# Altium project TMDX654GPEVM.PrjPcb (part 17 of 24)

## Sheet 36-ETHERNET PHY CLOCK GENERATOR.SchDoc
size 513 x 386 mm
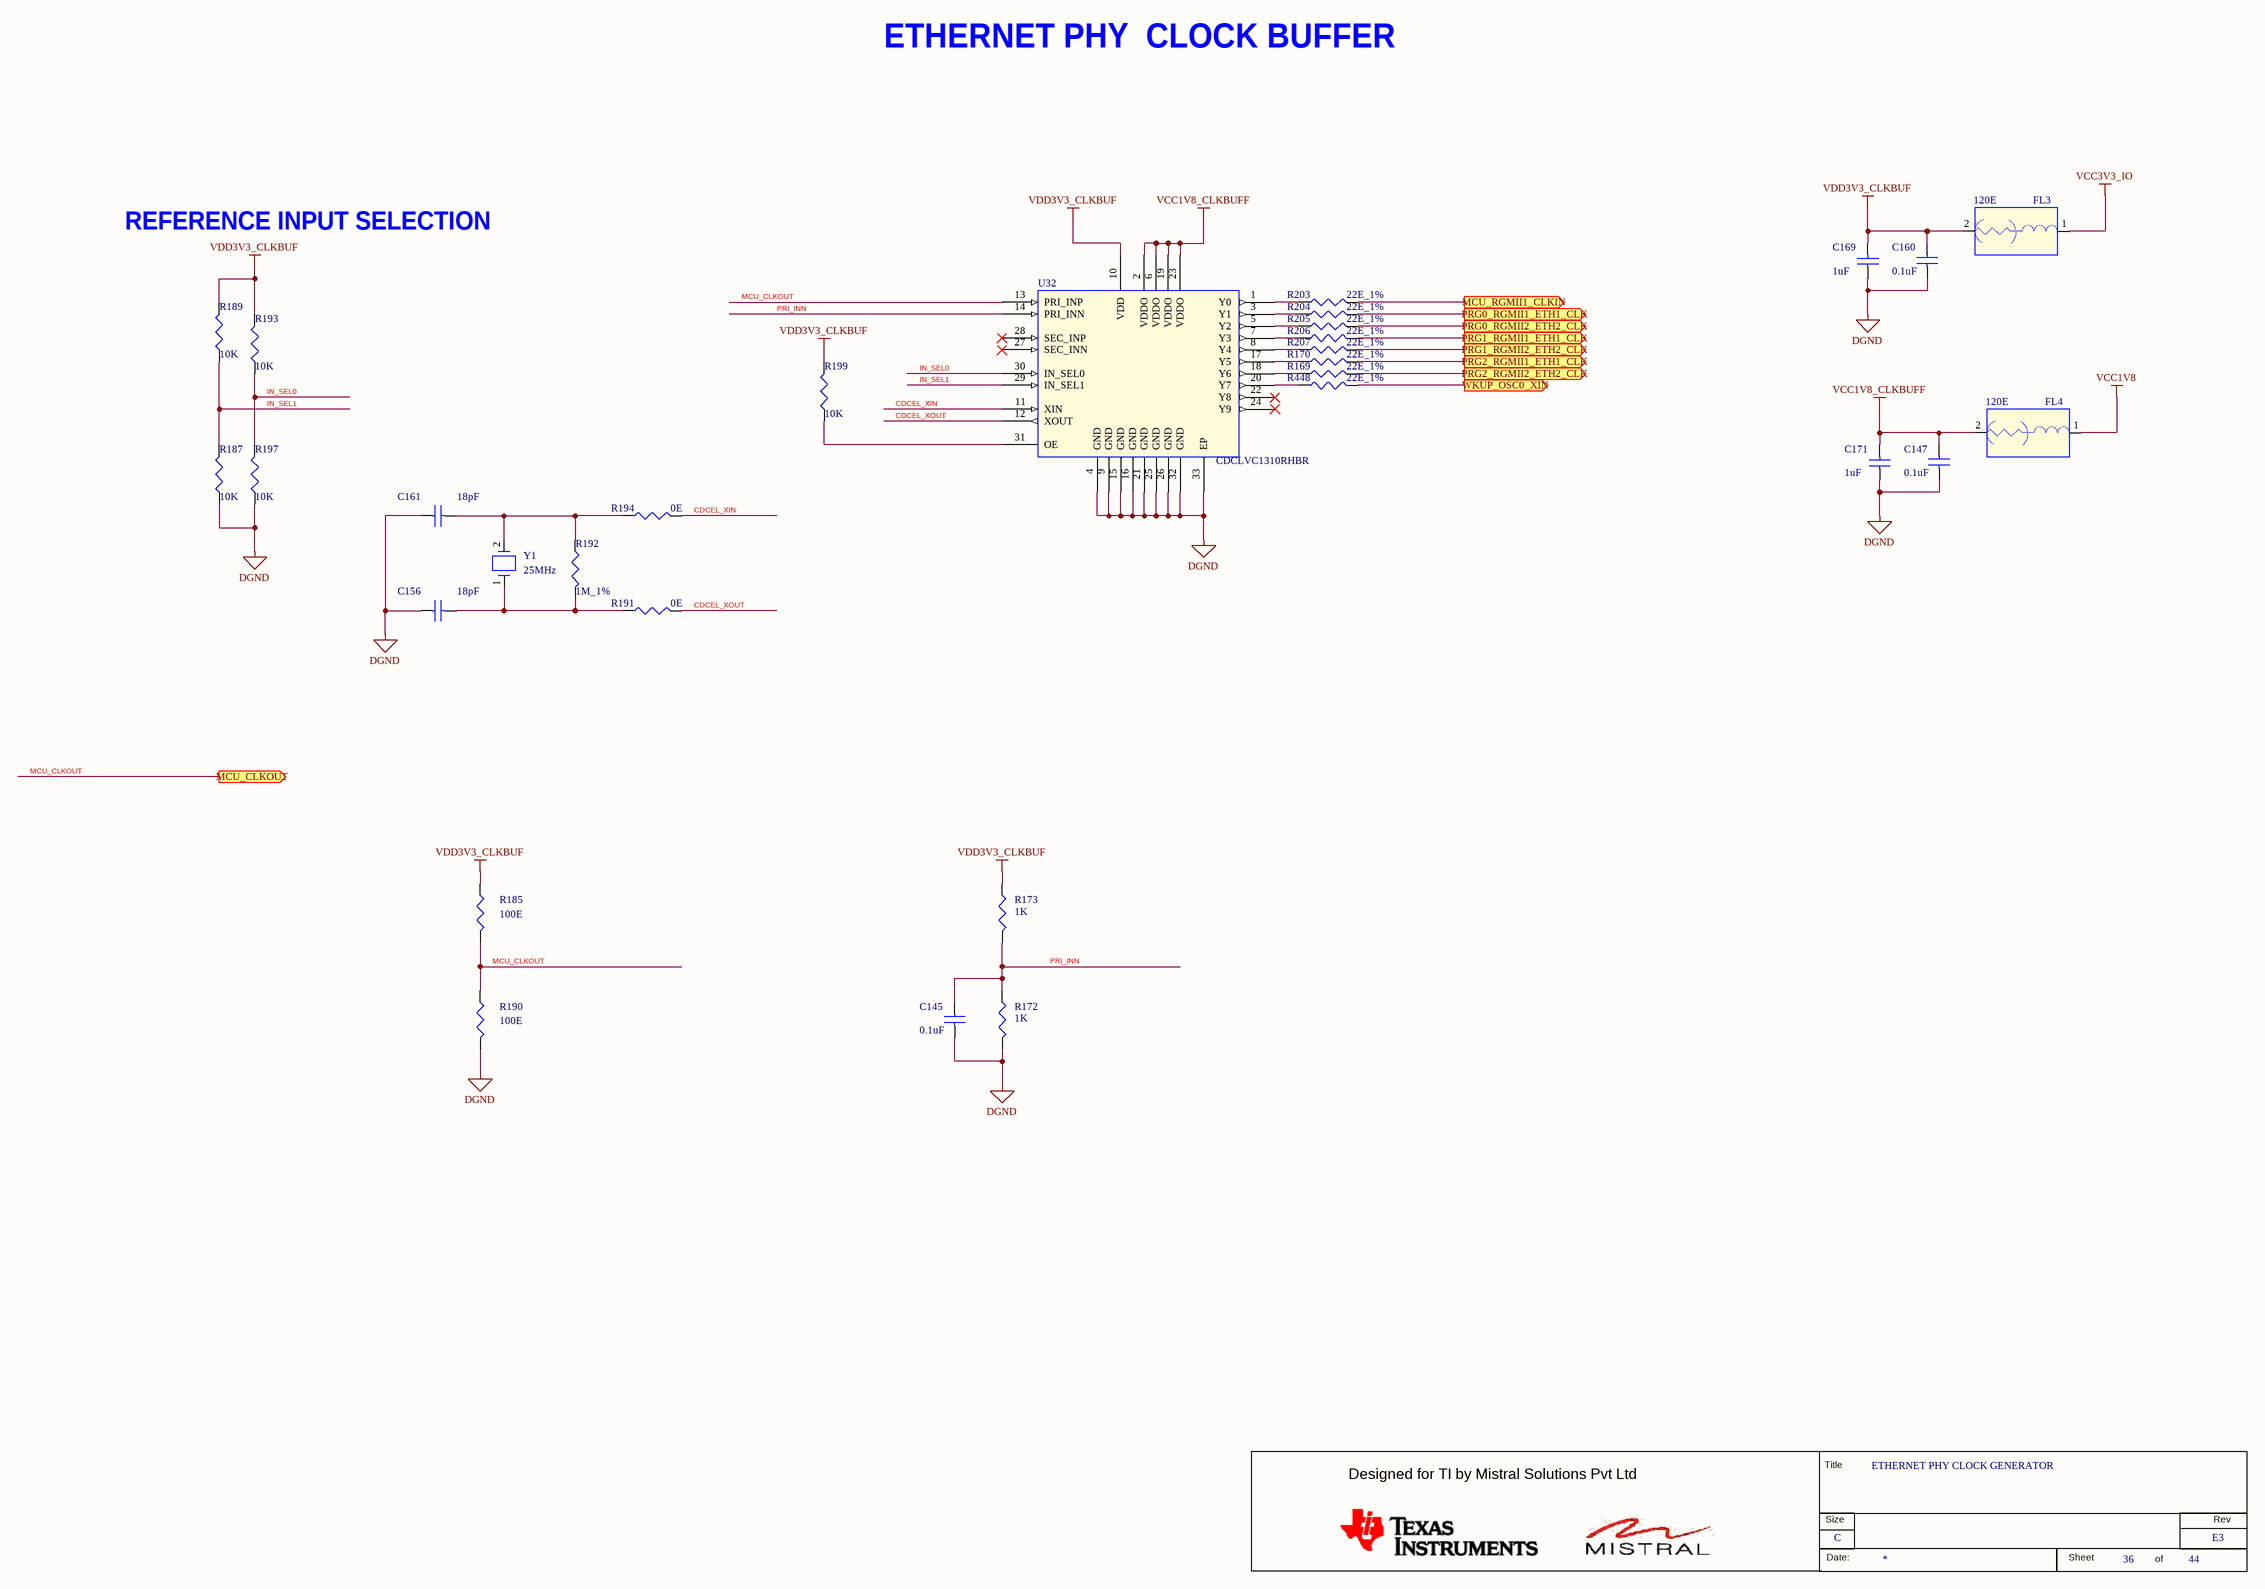
[diagram p68: 36-ETHERNET PHY CLOCK GENERATOR.SchDoc]

### Parts
(Parts that share a designator on the sheet are numbered #1, #2 ... from top to bottom, then left to right.)
*#36  RevCode: E3  Title: ETHERNET PHY CLOCK GENERATOR  Page Size: C  Page Number: 36  Page Count: 44  (hidden comment: MISTRAL_TITLEBLK_CSIZE)  (graphical)
C145  0.1uF  [CAP0201_0-5]
C147  0.1uF  [CAP0201_0-5]
C156  18pF  [CAP0402_0-75]
C160  0.1uF  [CAP0201_0-5]
C161  18pF  [CAP0402_0-75]
C169  1uF  [CAP0402_0-75]
C171  1uF  [CAP0402_0-75]
FL3  120E  [EMIFIL_BLM15A_0402_0-6]
FL4  120E  [EMIFIL_BLM15A_0402_0-6]
R169  22E_1%  [RES0402]
R170  22E_1%  [RES0402]
R172  1K  [RES0201]
R173  1K  [RES0201]
R185  100E  [RES0402_0-5]
R187  10K  [RES0402_0-5]
R189  10K  [RES0402_0-5]
R190  100E  [RES0402_0-5]
R191  0E  [RES0402_0-5]
R192  1M_1%  [RES0402]
R193  10K  [RES0402_0-5]
R194  0E  [RES0402_0-5]
R197  10K  [RES0402_0-5]
R199  10K  [RES0402_0-5]
R203  22E_1%  [RES0402]
R204  22E_1%  [RES0402]
R205  22E_1%  [RES0402]
R206  22E_1%  [RES0402]
R207  22E_1%  [RES0402]
R448  22E_1%  [RES0402]
U32  CDCLVC1310RHBR  [QFN32_19-68_200X200_1]
Y1  25MHz  [XTAL_ABM3_210X130_SMD]

### Ports
MCU_CLKOUT (out), MCU_RGMII1_CLKIN (out), PRG0_RGMII1_ETH1_CLK (out), PRG0_RGMII2_ETH2_CLK (out), PRG1_RGMII1_ETH1_CLK (out), PRG1_RGMII2_ETH2_CLK (out), PRG2_RGMII1_ETH1_CLK (out), PRG2_RGMII2_ETH2_CLK (out), WKUP_OSC0_XIN (out)

### Nets
DGND: C145.2 C147.2 C156.1 C160.2 C161.1 C169.1 C171.1 R172.2 R187.1 R190.2 R197.1 U32.4(GND) U32.9(GND) U32.15(GND) U32.16(GND) U32.21(GND) U32.25(GND) U32.26(GND) U32.32(GND) U32.33(EP)
VCC1V8: FL4.1
VCC1V8_CLKBUFF: C147.1 C171.2 FL4.2 U32.2(VDDO) U32.6(VDDO) U32.19(VDDO) U32.23(VDDO)
VCC3V3_IO: FL3.1
VDD3V3_CLKBUF: C160.1 C169.2 FL3.2 R173.1 R185.1 R189.2 R193.2 R199.2 U32.10(VDD)
CDCEL_XIN: R194.2 U32.11(XIN)
CDCEL_XOUT: R191.2 U32.12(XOUT)
IN_SEL0: R193.1 R197.2 U32.30(IN_SEL0)
IN_SEL1: R187.2 R189.1 U32.29(IN_SEL1)
MCU_CLKOUT: R185.2 R190.1 U32.13(PRI_INP) ; port MCU_CLKOUT
MCU_RGMII1_CLKIN: R203.2 ; port MCU_RGMII1_CLKIN
PRG0_RGMII1_ETH1_CLK: R204.2 ; port PRG0_RGMII1_ETH1_CLK
PRG0_RGMII2_ETH2_CLK: R205.2 ; port PRG0_RGMII2_ETH2_CLK
PRG1_RGMII1_ETH1_CLK: R206.2 ; port PRG1_RGMII1_ETH1_CLK
PRG1_RGMII2_ETH2_CLK: R207.2 ; port PRG1_RGMII2_ETH2_CLK
PRG2_RGMII1_ETH1_CLK: R170.2 ; port PRG2_RGMII1_ETH1_CLK
PRG2_RGMII2_ETH2_CLK: R169.2 ; port PRG2_RGMII2_ETH2_CLK
PRI_INN: C145.1 R172.1 R173.2 U32.14(PRI_INN)
WKUP_OSC0_XIN: R448.2 ; port WKUP_OSC0_XIN
NetC156_2: C156.2 R191.1 R192.2 Y1.1
NetC161_2: C161.2 R192.1 R194.1 Y1.2
NetR169_1: R169.1 U32.18(Y6)
NetR170_1: R170.1 U32.17(Y5)
NetR199_1: R199.1 U32.31(OE)
NetR203_1: R203.1 U32.1(Y0)
NetR204_1: R204.1 U32.3(Y1)
NetR205_1: R205.1 U32.5(Y2)
NetR206_1: R206.1 U32.7(Y3)
NetR207_1: R207.1 U32.8(Y4)
NetR448_1: R448.1 U32.20(Y7)

Not connected (* = marked no-connect by the designer): U32 22(Y8)* 24(Y9)* 27(SEC_INN)* 28(SEC_INP)*

### Notes on the sheet
- ETHERNET PHY  CLOCK BUFFER
- REFERENCE INPUT SELECTION
- (in symbol MISTRAL_TITLEBLK_CSIZE) Title; Designed for TI by Mistral Solutions Pvt Ltd; Size; Rev; Date:; Sheet; of

### Library data of the parts
*#36 = MISTRAL_TITLEBLK_CSIZE: Issue: 1.0; Page Create Date: March  8, 1995; Page Modify Date: *
C145 C147 = CAP_Dup5: CAP CERAMIC 0.1uF 16V 10% X5R 0201; Mistral Part No: 120009030072-R; Mfr_name: MURATA; Mfr_part_number: GRM033R61C104KE84J; Part_type: CAPACITORS\CERAMIC; Project: TI_MAXIE_CPB; Wattage: NA; Customs_HS_Code: 85322990; Custom_Duty: 15%; Library Ref: CAP; Tolerance: 10%; Voltage: 16V; Package: 0201; Distributor_name: DIGIKEY; Distributor_part_number: 490-16742-1-ND; Height: 0.33MM; Weight: 0.33mg; Temperature: -55°C+85°C; Datasheet: Y:\MIS_DATABASE\DATASHEETS\CAPACITORS\GRM033R61C104KE84.PDF; Crtd /date: MANIRAJA/120218; Chkd/date: MANIRAJA/120218; MECHANICAL 3D STEP FILE: CAP0201_0-5; PCB Footprint: CAP0201_0-5
C156 = CAP_Dup5: CAP CERAMIC 18pF 50V 5% C0G(NP0) 0402; Part_type: CAPACITORS\CERAMIC; Mfr_part_number: GRM1555C1H180JA01D; Mfr_name: MURATA; Mistral Part No: 120014050002-R; Custom_Duty: 15%; Customs_HS_Code: 85322990; Wattage: NA; Project: HUMANWARE_PHOENIX; Footprint Path: Y:\MIS_DATABASE\Library\ALTIUM_TOOL\PCB_FOOTPRINTS\Altium_Footprint_Lib.PcbLib; Library Path: Y:\MIS_DATABASE\Library\ALTIUM_TOOL\SCHEMATICS_PARTS\MS_DISCRETE_Library.schlib; MECHANICAL 3D STEP FILE: CAP0402_0-75; PCB Footprint: CAP0402_0-75; Footprint Ref: CAP0402_0-75; Library Ref: CAP; Chkd/date: VASANTHA/150514; Crtd /date: BALACHANDAR/150514; Datasheet: Y:\MIS_DATABASE\DATASHEETS\CAPACITORS\GRM188SERIES.PDF; Temperature: -55°C+125°C; Weight: 6mg; Height: 0.55MM; Distributor_part_number: 490-5858-1-ND; Distributor_name: DIGIKEY; Package: 0402; Voltage: 50V; Tolerance: 5%
C160 = CAP_Dup5: CAP CERAMIC 0.1uF 16V 10% X5R 0201; Part_type: CAPACITORS\CERAMIC; Mfr_part_number: GRM033R61C104KE84J; Mfr_name: MURATA; Mistral Part No: 120009030072-R; Custom_Duty: 15%; Customs_HS_Code: 85322990; Wattage: NA; Project: TI_MAXIE_CPB; Library Ref: CAP; PCB Footprint: CAP0201_0-5; MECHANICAL 3D STEP FILE: CAP0201_0-5; Chkd/date: MANIRAJA/120218; Crtd /date: MANIRAJA/120218; Datasheet: Y:\MIS_DATABASE\DATASHEETS\CAPACITORS\GRM033R61C104KE84.PDF; Temperature: -55°C+85°C; Weight: 0.33mg; Height: 0.33MM; Distributor_part_number: 490-16742-1-ND; Distributor_name: DIGIKEY; Package: 0201; Voltage: 16V; Tolerance: 10%
C161 = CAP_Dup5: CAP CERAMIC 18pF 50V 5% C0G(NP0) 0402; Mistral Part No: 120014050002-R; Mfr_name: MURATA; Mfr_part_number: GRM1555C1H180JA01D; Part_type: CAPACITORS\CERAMIC; Project: HUMANWARE_PHOENIX; Wattage: NA; Customs_HS_Code: 85322990; Custom_Duty: 15%; Footprint Path: Y:\MIS_DATABASE\Library\ALTIUM_TOOL\PCB_FOOTPRINTS\Altium_Footprint_Lib.PcbLib; Library Path: Y:\MIS_DATABASE\Library\ALTIUM_TOOL\SCHEMATICS_PARTS\MS_DISCRETE_Library.schlib; MECHANICAL 3D STEP FILE: CAP0402_0-75; PCB Footprint: CAP0402_0-75; Footprint Ref: CAP0402_0-75; Library Ref: CAP; Tolerance: 5%; Voltage: 50V; Package: 0402; Distributor_name: DIGIKEY; Distributor_part_number: 490-5858-1-ND; Height: 0.55MM; Weight: 6mg; Temperature: -55°C+125°C; Datasheet: Y:\MIS_DATABASE\DATASHEETS\CAPACITORS\GRM188SERIES.PDF; Crtd /date: BALACHANDAR/150514; Chkd/date: VASANTHA/150514
C169 = CAP_Dup5: CAP CERAMIC 1uF 16V 20% X5R 0402; Mistral Part No: 120018020006-R; Mfr_name: TAIYO YUDEN; Mfr_part_number: EMK105BJ105MV-F; Part_type: CAPACITORS\CERAMIC; Project: TI_MAXIE_CPB; Wattage: NA; Customs_HS_Code: 85322990; Custom_Duty: 15%; Footprint Ref: CAP0402_0-75; Library Ref: CAP; Tolerance: 20%; Voltage: 16V; Package: 0402; Distributor_name: DIGIKEY; Distributor_part_number: 587-5514-1-ND; Height: 0.55MM; Weight: 0.65mg; Temperature: -55°C+85°C; Datasheet: Y:\MIS_DATABASE\DATASHEETS\CAPACITORS\EMK105BJ105MV-F.PDF; Crtd /date: ALVY/150218; Chkd/date: MANIRAJA/150218; PCB Footprint: CAP0402_0-75; MECHANICAL 3D STEP FILE: CAP0402_0-75; Library Path: Y:\MIS_DATABASE\Library\ALTIUM_TOOL\SCHEMATICS_PARTS\MS_DISCRETE_Library.schlib; Footprint Path: Y:\MIS_DATABASE\Library\ALTIUM_TOOL\PCB_FOOTPRINTS\Altium_Footprint_Lib.PcbLib
C171 = CAP_Dup5: CAP CERAMIC 1uF 16V 20% X5R 0402; Part_type: CAPACITORS\CERAMIC; Mfr_part_number: EMK105BJ105MV-F; Mfr_name: TAIYO YUDEN; Mistral Part No: 120018020006-R; Custom_Duty: 15%; Customs_HS_Code: 85322990; Wattage: NA; Project: TI_MAXIE_CPB; Footprint Ref: CAP0402_0-75; Library Ref: CAP; Chkd/date: MANIRAJA/150218; Crtd /date: ALVY/150218; Datasheet: Y:\MIS_DATABASE\DATASHEETS\CAPACITORS\EMK105BJ105MV-F.PDF; Temperature: -55°C+85°C; Weight: 0.65mg; Height: 0.55MM; Distributor_part_number: 587-5514-1-ND; Distributor_name: DIGIKEY; Package: 0402; Voltage: 16V; Tolerance: 20%; PCB Footprint: CAP0402_0-75; MECHANICAL 3D STEP FILE: CAP0402_0-75; Library Path: Y:\MIS_DATABASE\Library\ALTIUM_TOOL\SCHEMATICS_PARTS\MS_DISCRETE_Library.schlib; Footprint Path: Y:\MIS_DATABASE\Library\ALTIUM_TOOL\PCB_FOOTPRINTS\Altium_Footprint_Lib.PcbLib
FL3 = EMIFILTER_IND: FERRITE CHIP 120E 1.3A 0402; Mistral Part No: 130012030043-R; Mfr_name: MURATA; Mfr_part_number: BLM15PD121SN1; Part_type: MISC\FILTER; Project: GEN_3-8; Tolerance: 25%; Voltage: NA; Customs_HS_Code: 85437099; Custom_Duty: 24%; Footprint Path: Y:\MIS_DATABASE\Library\ALTIUM_TOOL\PCB_FOOTPRINTS\Altium_Footprint_Lib.PcbLib; Library Path: Y:\MIS_DATABASE\Library\ALTIUM_TOOL\SCHEMATICS_PARTS\MS_FILTER_Library.schlib; Footprint Ref: EMIFIL_BLM15A_0402_0-6; Library Ref: EMIFILTER_IND; PCB Footprint: EMIFIL_BLM15A_0402_0-6; Wattage: NA; Package: 0402; Distributor_name: DIGIKEY; Distributor_part_number: 490-5203-1-ND; Height: 0.55MM; Weight: 0.65mg; Temperature: -55°C+125°C; Datasheet: Y:\MIS_DATABASE\DATASHEETS\DISCRETES\INDUCTORS\BLM18K-SERIES.PDF; Crtd /date: CHAITHANYA/150312; Chkd/date: VASANTHA/010117; MECHANICAL 3D STEP FILE: EMIFIL_BLM15A_0402_0-6
FL4 = EMIFILTER_IND: FERRITE CHIP 120E 1.3A 0402; Part_type: MISC\FILTER; Mfr_part_number: BLM15PD121SN1; Mfr_name: MURATA; Mistral Part No: 130012030043-R; Custom_Duty: 24%; Customs_HS_Code: 85437099; Wattage: NA; Tolerance: 25%; Project: GEN_3-8; Footprint Path: Y:\MIS_DATABASE\Library\ALTIUM_TOOL\PCB_FOOTPRINTS\Altium_Footprint_Lib.PcbLib; Library Path: Y:\MIS_DATABASE\Library\ALTIUM_TOOL\SCHEMATICS_PARTS\MS_FILTER_Library.schlib; Footprint Ref: EMIFIL_BLM15A_0402_0-6; Library Ref: EMIFILTER_IND; PCB Footprint: EMIFIL_BLM15A_0402_0-6; MECHANICAL 3D STEP FILE: EMIFIL_BLM15A_0402_0-6; Chkd/date: VASANTHA/010117; Crtd /date: CHAITHANYA/150312; Datasheet: Y:\MIS_DATABASE\DATASHEETS\DISCRETES\INDUCTORS\BLM18K-SERIES.PDF; Temperature: -55°C+125°C; Weight: 0.65mg; Height: 0.55MM; Distributor_part_number: 490-5203-1-ND; Distributor_name: DIGIKEY; Package: 0402; Voltage: NA
R169 R203 R205 R207 = RESISTOR_Dup4: RES 22E 1/16W 1% 0402; Cust_part_number: 4700-80047E; Alternate_mfr_part_number_A: CRCW040222R0FKED; Alternate_mfr_name_A: VISHAY; Part_type: RESISTORS\FIXED; Mfr_part_number: RC0402FR-0722RL; Mfr_name: YAGEO AMERICA; Mistral Part No: 110009090004-P; Remarks: In alternate datasheet it is RoHS COMPLIANT. Y:\MIS_DATABASE\DATASHEETS\RESISTORS\CRCW0402.PDF; Custom_Duty: 15%; Customs_HS_Code: 85332119; Voltage: 50V; Project: VMEFMCD; SIGNAL_MODEL: RESISTOR_RES0402_22E_22E; Library Ref: RESISTOR; RoHS: Pb-Free; Chkd/date: SUHAS/290910; Crtd /date: MAZHAR/090909; Datasheet: Y:\MIS_DATABASE\DATASHEETS\RESISTORS\YAGEO-RC0402.PDF; Temperature: -55°C+155°C; Weight: 0.8g/1000pcs; Height: 0.40MM; Distributor_part_number_A: 541-22.0LCT-ND; Distributor_name_A: DIGIKEY; Distributor_part_number: 311-22.0LRCT-ND; Distributor_name: DIGIKEY; Package: 0402; Wattage: 1/16W; Tolerance: 1%; PCB Footprint: RES0402
R170 R204 R206 = RESISTOR_Dup4: RES 22E 1/16W 1% 0402; Mistral Part No: 110009090004-P; Mfr_name: YAGEO AMERICA; Mfr_part_number: RC0402FR-0722RL; Part_type: RESISTORS\FIXED; Alternate_mfr_name_A: VISHAY; Alternate_mfr_part_number_A: CRCW040222R0FKED; Cust_part_number: 4700-80047E; SIGNAL_MODEL: RESISTOR_RES0402_22E_22E; Project: VMEFMCD; Voltage: 50V; Customs_HS_Code: 85332119; Custom_Duty: 15%; Remarks: In alternate datasheet it is RoHS COMPLIANT. Y:\MIS_DATABASE\DATASHEETS\RESISTORS\CRCW0402.PDF; Library Ref: RESISTOR; Tolerance: 1%; Wattage: 1/16W; Package: 0402; Distributor_name: DIGIKEY; Distributor_part_number: 311-22.0LRCT-ND; Distributor_name_A: DIGIKEY; Distributor_part_number_A: 541-22.0LCT-ND; Height: 0.40MM; Weight: 0.8g/1000pcs; Temperature: -55°C+155°C; Datasheet: Y:\MIS_DATABASE\DATASHEETS\RESISTORS\YAGEO-RC0402.PDF; Crtd /date: MAZHAR/090909; Chkd/date: SUHAS/290910; RoHS: Pb-Free; PCB Footprint: RES0402
R172 R173 = RESISTOR_Dup5: RES 1K 1/20W 5% 0201; Mistral Part No: 110015080014-R; Mfr_name: VISHAY; Mfr_part_number: CRCW02011K00FKED; Part_type: RESISTORS\FIXED; Project: OCTASIC_3000; Voltage: NA; Customs_HS_Code: 85332119; Custom_Duty: 15%; Library Ref: RESISTOR; Tolerance: 5%; Wattage: 1/20W; Package: 0201; Distributor_name: DIGIKEY; Distributor_part_number: 541-1.00KAABCT-ND; Height: 0.28MM; Weight: NA; Temperature: -55°C+155°C; Datasheet: Y:\MIS_DATABASE\DATASHEETS\RESISTORS\CRCW0201.PDF; Crtd /date: JEBRAN/110815; Chkd/date: JEBRAN/110815; PCB Footprint: RES0201
R185 R190 = RESISTOR_Dup5: RES 100E 1/16W 5% 0402; Mistral Part No: 110009030164-R; Mfr_name: VISHAY; Mfr_part_number: CRCW0402100RJNED; Part_type: RESISTORS\FIXED; Project: TI_MAXIE_CPB; Voltage: NA; Customs_HS_Code: 85332119; Custom_Duty: 15%; Library Ref: RESISTOR; Tolerance: 5%; Wattage: 1/16W; Package: 0402; Distributor_name: DIGIKEY; Distributor_part_number: 541-100JCT-ND; Height: 0.40MM; Weight: 0.65mg; Temperature: -55°C+155°C; Datasheet: Y:\MIS_DATABASE\DATASHEETS\RESISTORS\CRCW0603.PDF; Crtd /date: MANIRAJA/230817; Chkd/date: MANIRAJA/230817; MECHANICAL 3D STEP FILE: RES0402_0-5; PCB Footprint: RES0402_0-5
R187 R193 = RESISTOR_Dup5: RES 10K 1/16W 5% 0402; Mistral Part No: 110009030208-R; Mfr_name: YAGEO AMERICA; Mfr_part_number: RC0402JR-0710KL; Part_type: RESISTORS\FIXED; Project: HSE; Voltage: NA; Customs_HS_Code: 85332119; Custom_Duty: 15%; NI_MARK: DNI; Footprint Path: Y:\MIS_DATABASE\Library\ALTIUM_TOOL\PCB_FOOTPRINTS\Altium_Footprint_Lib.PcbLib; Library Path: Y:\MIS_DATABASE\Library\ALTIUM_TOOL\SCHEMATICS_PARTS\MS_DISCRETE_Library.schlib; Footprint Ref: RES0402_0-5; Library Ref: RESISTOR; PCB Footprint: RES0402_0-5; Tolerance: 5%; Wattage: 1/16W; Package: 0402; Distributor_name: DIGIKEY; Distributor_part_number: 311-10KJRCT-ND; Height: 0.40MM; Weight: 0.65mg; Temperature: -55°C+155°C; Datasheet: Y:\MIS_DATABASE\DATASHEETS\RESISTORS\YAGEO-RC0402.PDF; Crtd /date: MAZHAR/230805; Chkd/date: VASANTHA/061216; RoHS: Pb-Free; MECHANICAL 3D STEP FILE: RES0402_0-5
R189 R197 = RESISTOR_Dup5: RES 10K 1/16W 5% 0402; Part_type: RESISTORS\FIXED; Mfr_part_number: RC0402JR-0710KL; Mfr_name: YAGEO AMERICA; Mistral Part No: 110009030208-R; Custom_Duty: 15%; Customs_HS_Code: 85332119; Voltage: NA; Project: HSE; Footprint Path: Y:\MIS_DATABASE\Library\ALTIUM_TOOL\PCB_FOOTPRINTS\Altium_Footprint_Lib.PcbLib; Library Path: Y:\MIS_DATABASE\Library\ALTIUM_TOOL\SCHEMATICS_PARTS\MS_DISCRETE_Library.schlib; Footprint Ref: RES0402_0-5; Library Ref: RESISTOR; PCB Footprint: RES0402_0-5; MECHANICAL 3D STEP FILE: RES0402_0-5; RoHS: Pb-Free; Chkd/date: VASANTHA/061216; Crtd /date: MAZHAR/230805; Datasheet: Y:\MIS_DATABASE\DATASHEETS\RESISTORS\YAGEO-RC0402.PDF; Temperature: -55°C+155°C; Weight: 0.65mg; Height: 0.40MM; Distributor_part_number: 311-10KJRCT-ND; Distributor_name: DIGIKEY; Package: 0402; Wattage: 1/16W; Tolerance: 5%
R191 = RESISTOR_Dup4: RES 0E 1/16W 0402; Part_type: RESISTORS\FIXED; Mfr_part_number: CRCW04020000Z0ED; Mfr_name: VISHAY; Mistral Part No: 110010080019-P; Custom_Duty: 15%; Customs_HS_Code: 85332119; Voltage: NA; Project: PB_BUGBASE; Footprint Path: Y:\MIS_DATABASE\Library\ALTIUM_TOOL\PCB_FOOTPRINTS\Altium_Footprint_Lib.PcbLib; Library Path: Y:\MIS_DATABASE\Library\ALTIUM_TOOL\SCHEMATICS_PARTS\MS_DISCRETE_Library.schlib; Footprint Ref: RES0402_0-5; Library Ref: RESISTOR; PCB Footprint: RES0402_0-5; RoHS: Pb-Free; Chkd/date: VASANTHA/201216; Crtd /date: MUDDU/190810; Datasheet: Y:\MIS_DATABASE\DATASHEETS\RESISTORS\CRCW0603.PDF; Temperature: -55°C+155°C; Weight: 0.65g/1000pcs; Height: 0.40MM; Distributor_part_number: 541-0.0JCT-ND; Distributor_name: DIGIKEY; Package: 0402; Wattage: 1/16W; Tolerance: NA; MECHANICAL 3D STEP FILE: RES0402_0-5
R192 = RESISTOR_Dup5: RES 1M 1/16W 1% 0402; Mistral Part No: 110014060045-R; Mfr_name: STACKPOLE ELECTRONICS; Mfr_part_number: RMCF0402FT1M00; Part_type: RESISTORS\FIXED; Project: AEGIS_POM; Voltage: NA; Customs_HS_Code: 85332119; Custom_Duty: 15%; NI_MARK: DNI; Footprint Path: Y:\MIS_DATABASE\Library\ALTIUM_TOOL\PCB_FOOTPRINTS\Altium_Footprint_Lib.PcbLib; Library Path: Y:\MIS_DATABASE\Library\ALTIUM_TOOL\SCHEMATICS_PARTS\MS_DISCRETE_Library.schlib; Footprint Ref: RES0402; Library Ref: RESISTOR; PCB Footprint: RES0402; Tolerance: 1%; Wattage: 1/16W; Package: 0402; Distributor_name: DIGIKEY; Distributor_part_number: RMCF0402FT1M00CT-ND; Height: 0.40MM; Weight: 0.57mg; Temperature: -55°C+155°C; Datasheet: Y:\MIS_DATABASE\DATASHEETS\RESISTORS\RMCF-SERIES1.PDF; Crtd /date: NAVEED/170614; Chkd/date: VASANTHA/200614
R194 = RESISTOR_Dup4: RES 0E 1/16W 0402; Mistral Part No: 110010080019-P; Mfr_name: VISHAY; Mfr_part_number: CRCW04020000Z0ED; Part_type: RESISTORS\FIXED; Project: PB_BUGBASE; Tolerance: NA; Customs_HS_Code: 85332119; Custom_Duty: 15%; Footprint Path: Y:\MIS_DATABASE\Library\ALTIUM_TOOL\PCB_FOOTPRINTS\Altium_Footprint_Lib.PcbLib; Library Path: Y:\MIS_DATABASE\Library\ALTIUM_TOOL\SCHEMATICS_PARTS\MS_DISCRETE_Library.schlib; Footprint Ref: RES0402_0-5; Library Ref: RESISTOR; PCB Footprint: RES0402_0-5; Voltage: NA; Wattage: 1/16W; Package: 0402; Distributor_name: DIGIKEY; Distributor_part_number: 541-0.0JCT-ND; Height: 0.40MM; Weight: 0.65g/1000pcs; Temperature: -55°C+155°C; Datasheet: Y:\MIS_DATABASE\DATASHEETS\RESISTORS\CRCW0603.PDF; Crtd /date: MUDDU/190810; Chkd/date: VASANTHA/201216; RoHS: Pb-Free; MECHANICAL 3D STEP FILE: RES0402_0-5
R199 = RESISTOR_Dup5: RES 10K 1/16W 5% 0402; Mistral Part No: 110009030208-R; Mfr_name: YAGEO AMERICA; Mfr_part_number: RC0402JR-0710KL; Part_type: RESISTORS\FIXED; Project: HSE; Voltage: NA; Customs_HS_Code: 85332119; Custom_Duty: 15%; Footprint Path: Y:\MIS_DATABASE\Library\ALTIUM_TOOL\PCB_FOOTPRINTS\Altium_Footprint_Lib.PcbLib; Library Path: Y:\MIS_DATABASE\Library\ALTIUM_TOOL\SCHEMATICS_PARTS\MS_DISCRETE_Library.schlib; Footprint Ref: RES0402_0-5; Library Ref: RESISTOR; Tolerance: 5%; Wattage: 1/16W; Package: 0402; Distributor_name: DIGIKEY; Distributor_part_number: 311-10KJRCT-ND; Height: 0.40MM; Weight: 0.65mg; Temperature: -55°C+155°C; Datasheet: Y:\MIS_DATABASE\DATASHEETS\RESISTORS\YAGEO-RC0402.PDF; Crtd /date: MAZHAR/230805; Chkd/date: VASANTHA/061216; RoHS: Pb-Free; MECHANICAL 3D STEP FILE: RES0402_0-5; PCB Footprint: RES0402_0-5
R448 = RESISTOR_Dup4: RES 22E 1/16W 1% 0402; Cust_part_number: 4700-80047E; Alternate_mfr_part_number_A: CRCW040222R0FKED; Alternate_mfr_name_A: VISHAY; Part_type: RESISTORS\FIXED; Mfr_part_number: RC0402FR-0722RL; Mfr_name: YAGEO AMERICA; Mistral Part No: 110009090004-P; Remarks: In alternate datasheet it is RoHS COMPLIANT. Y:\MIS_DATABASE\DATASHEETS\RESISTORS\CRCW0402.PDF; Custom_Duty: 15%; Customs_HS_Code: 85332119; Voltage: 50V; Project: VMEFMCD; SIGNAL_MODEL: RESISTOR_RES0402_22E_22E; NI_MARK: DNI; Library Ref: RESISTOR; RoHS: Pb-Free; Chkd/date: SUHAS/290910; Crtd /date: MAZHAR/090909; Datasheet: Y:\MIS_DATABASE\DATASHEETS\RESISTORS\YAGEO-RC0402.PDF; Temperature: -55°C+155°C; Weight: 0.8g/1000pcs; Height: 0.40MM; Distributor_part_number_A: 541-22.0LCT-ND; Distributor_name_A: DIGIKEY; Distributor_part_number: 311-22.0LRCT-ND; Distributor_name: DIGIKEY; Package: 0402; Wattage: 1/16W; Tolerance: 1%; PCB Footprint: RES0402
U32 = CDCLVC1310RHBR_VQFN32: IC LOW JITTER,LOW POWER CLK BUFFER LEVEL TRANSLATOR VQFN32; Part_type: ICS\INTERFACE\LEVEL TRANSLATOR; Mfr_name: TEXAS INSTRUMENTS; Mistral Part No: 141017100003-R; Custom_Duty: 15%; Customs_HS_Code: 85423100; Wattage: NA; Project: TI_MAXIE_CPB; Library Ref: CDCLVC1310RHBR_VQFN32; PCB Footprint: QFN32_19-68_200X200_1; MECHANICAL 3D STEP FILE: QFN32_19-68_200X200_1; Chkd/date: MANIRAJA/061017; Crtd /date: MANIRAJA/061017; Datasheet: Y:\MIS_DATABASE\DATASHEETS\ICS\INTERFACE\CDCLVC1310RHBR.PDF; Temperature: -40°C+85°C; Weight: 72.2mg; Height: 1.00MM; Distributor_part_number: 296-30105-1-ND; Distributor_name: DIGIKEY; Package: VQFN32; Voltage: NA; Tolerance: NA; Mfr_part_number: CDCLVC1310RHBR
Y1 = CRY: CRY 25MHz SMD; Part_type: CRYSTAL; Mfr_part_number: 445I23D25M00000; Mfr_name: CTS; Mistral Part No: 130011100003-R; Custom_Duty: 24%; Customs_HS_Code: 85439000; Wattage: NA; Project: VP-4000-PROCESSOR; Library Ref: CRY; PCB Footprint: XTAL_ABM3_210X130_SMD; Chkd/date: BAVISH/041011; Crtd /date: CHAITHANYA/041011; Datasheet: Y:\MIS_DATABASE\DATASHEETS\MISC\CRY_OSC\ABM3.PDF; Temperature: -40°C+85°C; Weight: NA; Height: 1.50MM; Distributor_part_number: 535-10645-1-ND; Distributor_name: DIGIKEY; Package: SMD; Voltage: NA; Tolerance: NA

## Sheet 37-ETHERNET LEDs.SchDoc
size 513 x 386 mm
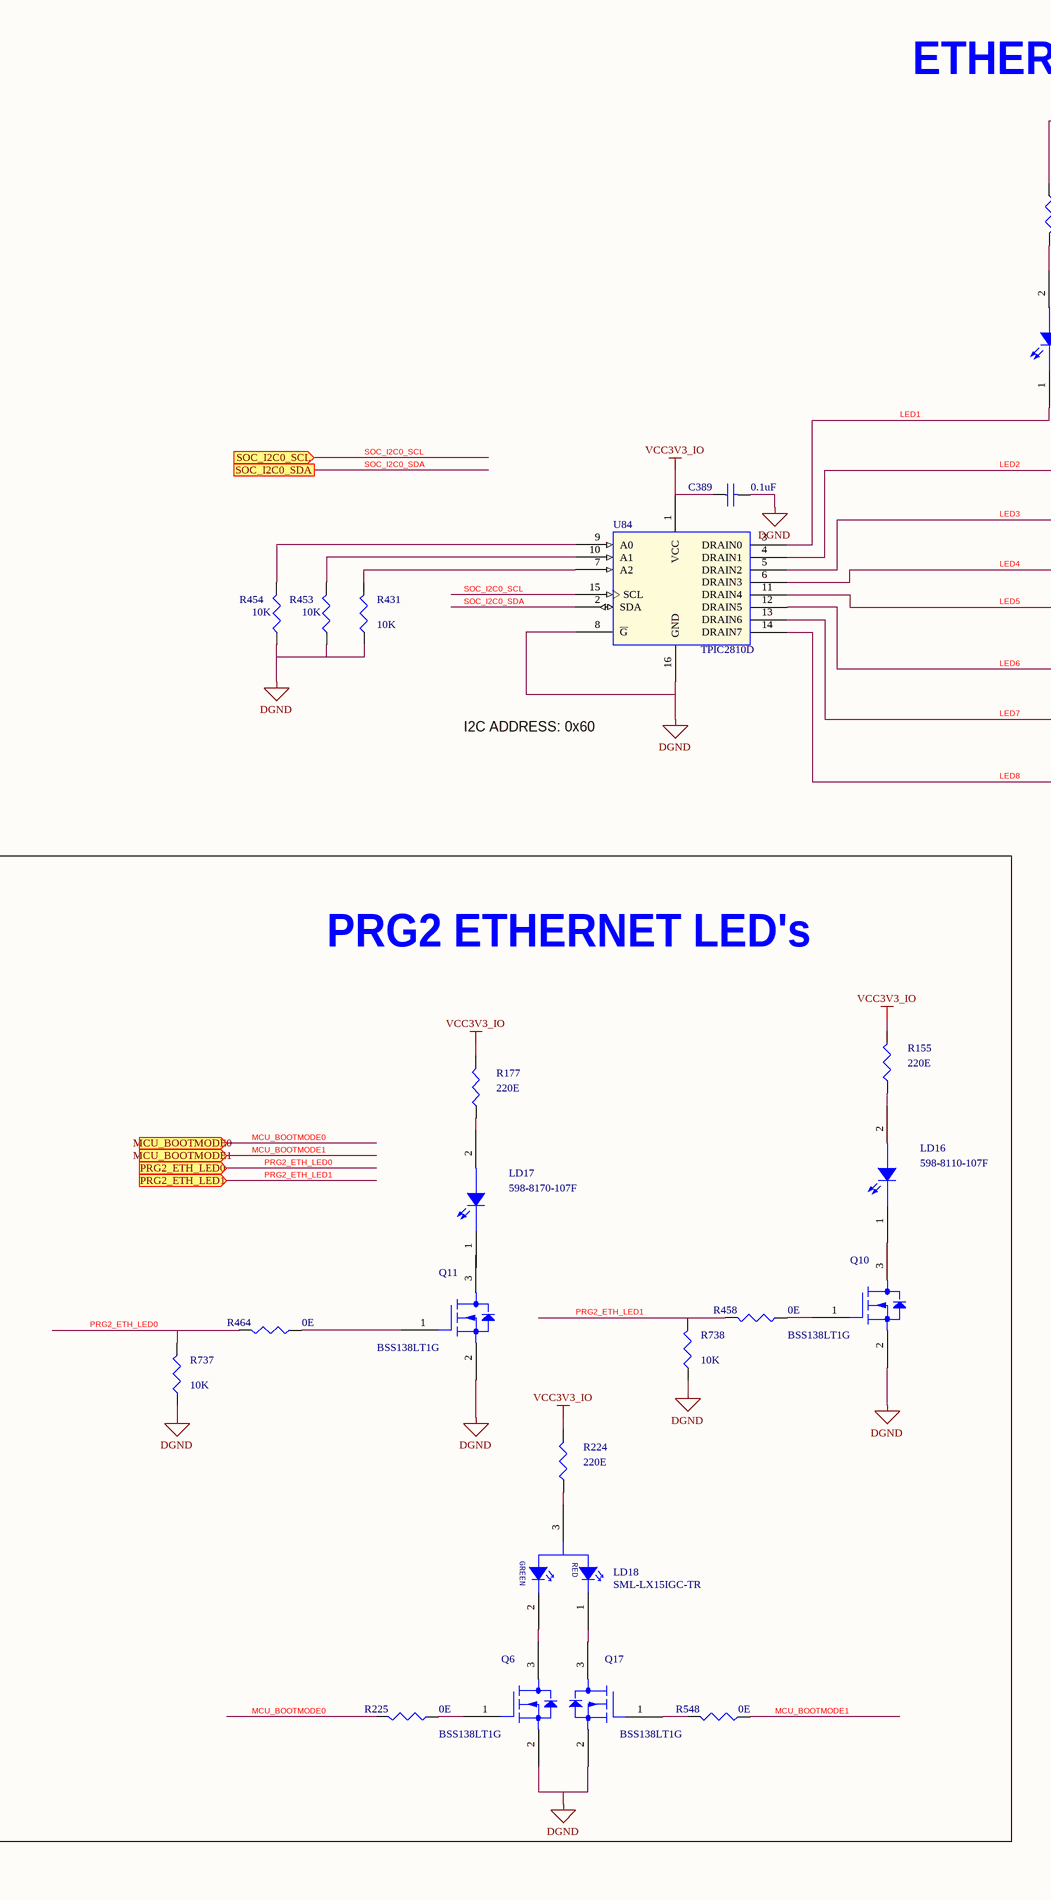
[diagram p69: 37-ETHERNET LEDs.SchDoc, left]
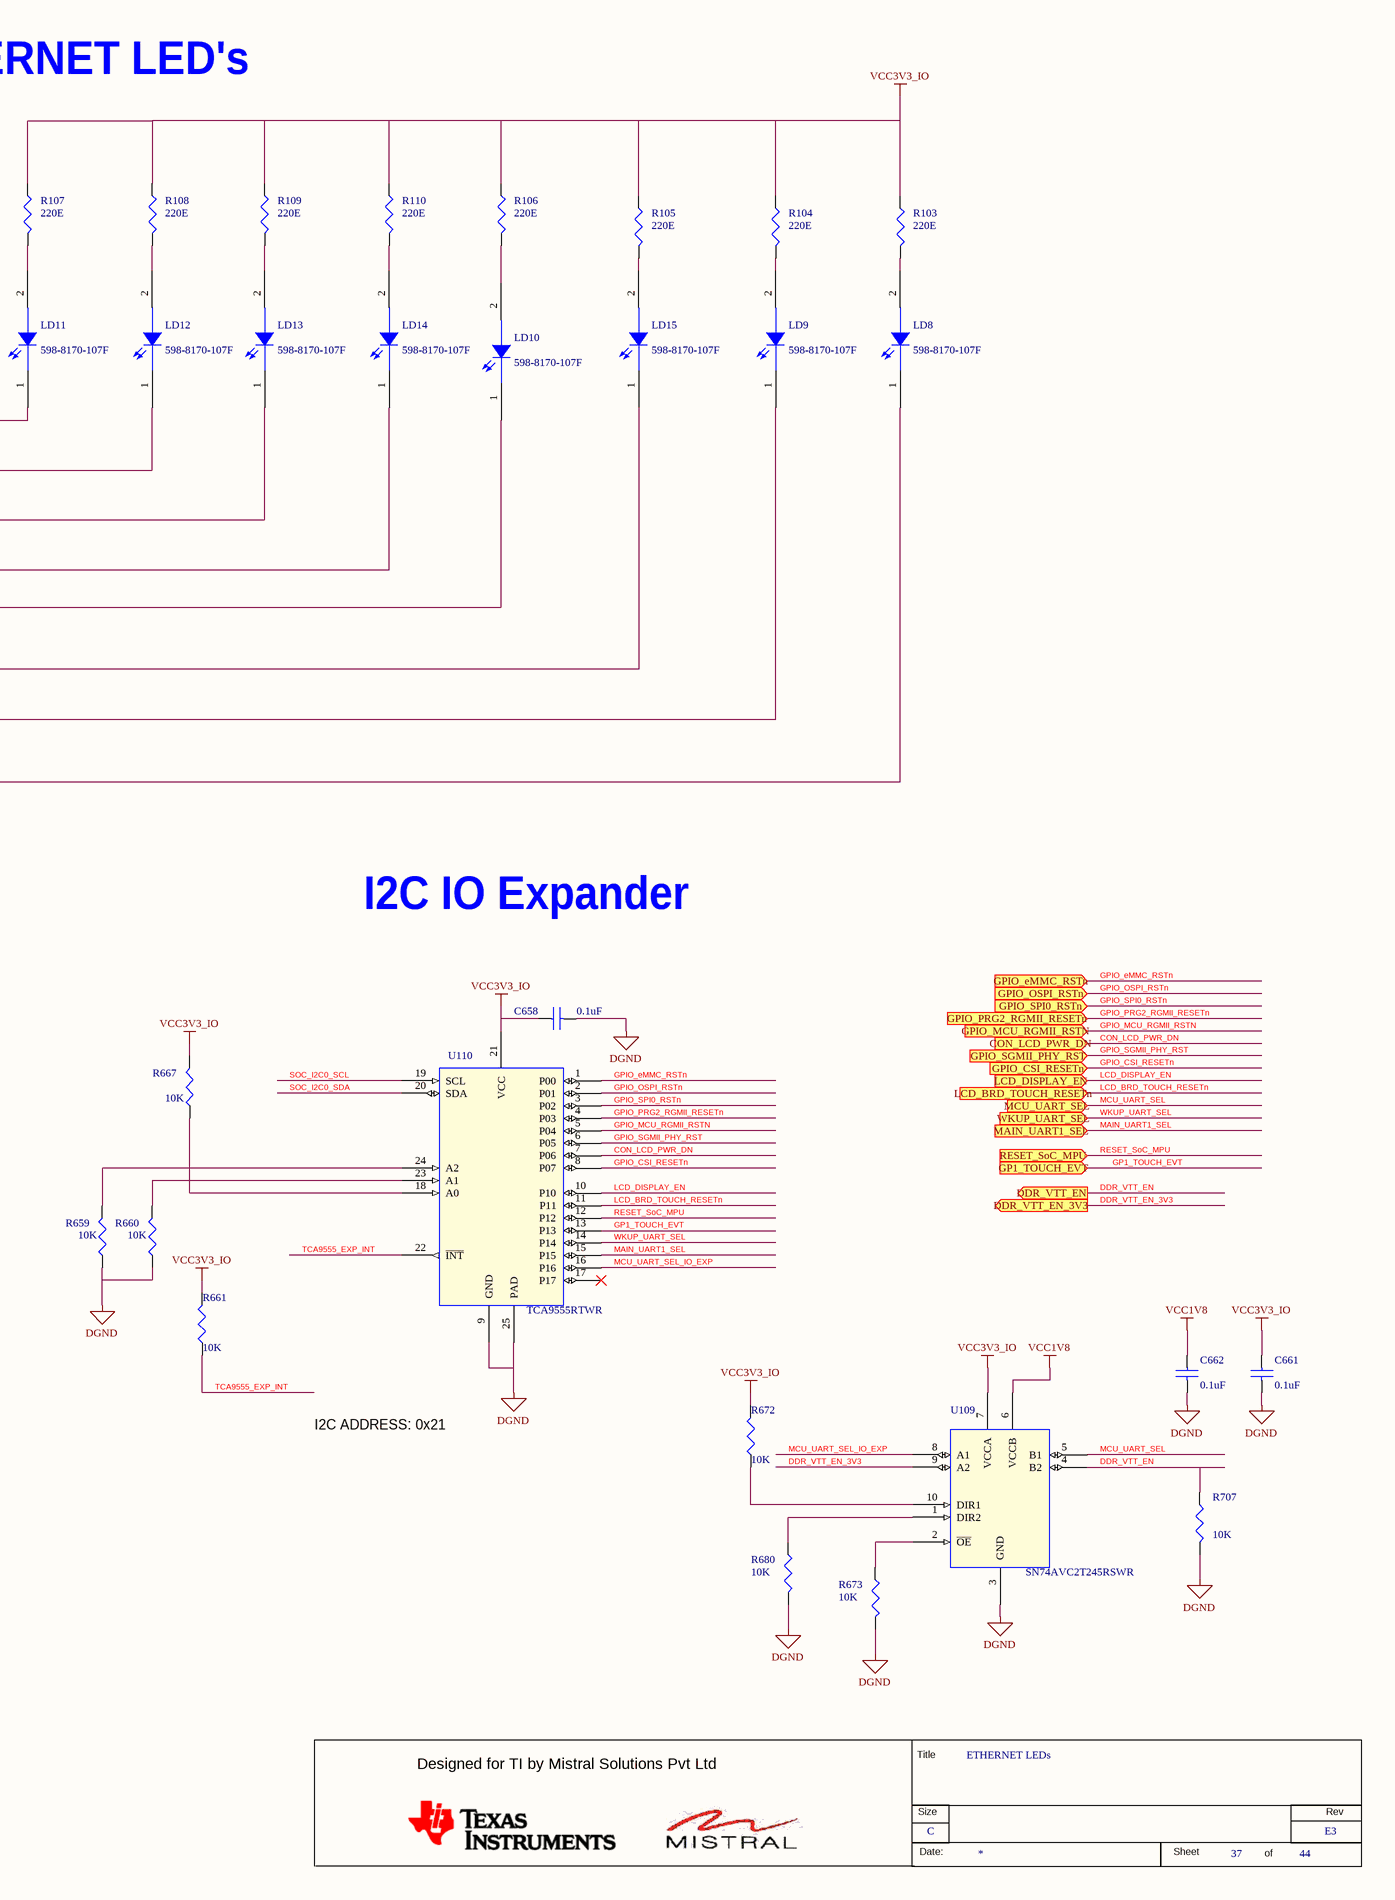
[diagram p70: 37-ETHERNET LEDs.SchDoc, right]

### Parts
(Parts that share a designator on the sheet are numbered #1, #2 ... from top to bottom, then left to right.)
*#37  RevCode: E3  Title: ETHERNET LEDs  Page Size: C  Page Number: 37  Page Count: 44  (hidden comment: MISTRAL_TITLEBLK_CSIZE)  (graphical)
C389  0.1uF  [CAP0201_0-5]
C658  0.1uF  [CAP0201_0-5]
C661  0.1uF  [CAP0201_0-5]
C662  0.1uF  [CAP0201_0-5]
LD8  598-8170-107F  [LED_0805_0-7]
LD9  598-8170-107F  [LED_0805_0-7]
LD10  598-8170-107F  [LED_0805_0-7]
LD11  598-8170-107F  [LED_0805_0-7]
LD12  598-8170-107F  [LED_0805_0-7]
LD13  598-8170-107F  [LED_0805_0-7]
LD14  598-8170-107F  [LED_0805_0-7]
LD15  598-8170-107F  [LED_0805_0-7]
LD16  598-8110-107F  [LED_0805]
LD17  598-8170-107F  [LED_0805_0-7]
LD18  SML-LX15IGC-TR  [LED3_SML-LX15IGC_120X120_SMD_1]
Q6  BSS138LT1G  [SOT23-123]
Q10  BSS138LT1G  [SOT23-123]
Q11  BSS138LT1G  [SOT23-123]
Q17  BSS138LT1G  [SOT23-123]
R103  220E  [RES0402_0-5]
R104  220E  [RES0402_0-5]
R105  220E  [RES0402_0-5]
R106  220E  [RES0402_0-5]
R107  220E  [RES0402_0-5]
R108  220E  [RES0402_0-5]
R109  220E  [RES0402_0-5]
R110  220E  [RES0402_0-5]
R155  220E  [RES0402_0-5]
R177  220E  [RES0402_0-5]
R224  220E  [RES0402_0-5]
R225  0E  [RES0402_0-5]
R431  10K  [RES0402_0-5]
R453  10K  [RES0402_0-5]
R454  10K  [RES0402_0-5]
R458  0E  [RES0402_0-5]
R464  0E  [RES0402_0-5]
R548  0E  [RES0402_0-5]
R659  10K  [RES0402_0-5]
R660  10K  [RES0402_0-5]
R661  10K  [RES0402_0-5]
R667  10K  [RES0402_0-5]
R672  10K  [RES0402_0-5]
R673  10K  [RES0402_0-5]
R680  10K  [RES0402_0-5]
R707  10K  [RES0402_0-5]
R737  10K  [RES0402_0-5]
R738  10K  [RES0402_0-5]
U84  TPIC2810D  [SOIC16_1-8]
U109  SN74AVC2T245RSWR  [QFN10_15-74_75X60]
U110  TCA9555RTWR  [QFN24_19-68_165X165]

### Blocks framed on the sheet
PRG2 ETHERNET LED's: LD16-LD18 Q6 Q10 Q11 Q17 R155 R177 R224 R225 R458 R464 R548 R737 R738

### Ports
CON_LCD_PWR_DN (in), DDR_VTT_EN (out), DDR_VTT_EN_3V3 (out), GP1_TOUCH_EVT (in), GPIO_CSI_RESETn (in), GPIO_eMMC_RSTn (in), GPIO_MCU_RGMII_RSTN (in), GPIO_OSPI_RSTn (in), GPIO_PRG2_RGMII_RESETn (in), GPIO_SGMII_PHY_RST (in), GPIO_SPI0_RSTn (in), LCD_BRD_TOUCH_RESETn (in), LCD_DISPLAY_EN (in), MAIN_UART1_SEL (in), MCU_BOOTMODE0 (in), MCU_BOOTMODE1 (in), MCU_UART_SEL (in), PRG2_ETH_LED0 (in), PRG2_ETH_LED1 (in), RESET_SoC_MPU (in), SOC_I2C0_SCL (in), SOC_I2C0_SDA, WKUP_UART_SEL (in)

### Nets
DGND: C389.2 C658.2 C661.2 C662.2 Q6.2(S) Q10.2(S) Q11.2(S) Q17.2(S) R431.1 R453.1 R454.1 R659.1 R660.1 R673.2 R680.2 R707.2 R737.1 R738.1 U84.8(~{G}) U84.16(GND) U109.3(GND) U110.9(GND) U110.25(PAD)
VCC1V8: C662.1 U109.6(VCCB)
VCC3V3_IO: C389.1 C658.1 C661.1 R103.1 R104.1 R105.1 R106.1 R107.1 R108.1 R109.1 R110.1 R155.2 R177.2 R224.2 R661.2 R667.2 R672.2 U84.1(VCC) U109.7(VCCA) U110.21(VCC)
CON_LCD_PWR_DN: U110.7(P06) ; port CON_LCD_PWR_DN
DDR_VTT_EN: R707.1 U109.4(B2) ; port DDR_VTT_EN
DDR_VTT_EN_3V3: U109.9(A2) ; port DDR_VTT_EN_3V3
GP1_TOUCH_EVT: U110.13(P13) ; port GP1_TOUCH_EVT
GPIO_CSI_RESETn: U110.8(P07) ; port GPIO_CSI_RESETn
GPIO_eMMC_RSTn: U110.1(P00) ; port GPIO_eMMC_RSTn
GPIO_MCU_RGMII_RSTN: U110.5(P04) ; port GPIO_MCU_RGMII_RSTN
GPIO_OSPI_RSTn: U110.2(P01) ; port GPIO_OSPI_RSTn
GPIO_PRG2_RGMII_RESETn: U110.4(P03) ; port GPIO_PRG2_RGMII_RESETn
GPIO_SGMII_PHY_RST: U110.6(P05) ; port GPIO_SGMII_PHY_RST
GPIO_SPI0_RSTn: U110.3(P02) ; port GPIO_SPI0_RSTn
LCD_BRD_TOUCH_RESETn: U110.11(P11) ; port LCD_BRD_TOUCH_RESETn
LCD_DISPLAY_EN: U110.10(P10) ; port LCD_DISPLAY_EN
LED1: LD11.1 U84.3(DRAIN0)
LED2: LD12.1 U84.4(DRAIN1)
LED3: LD13.1 U84.5(DRAIN2)
LED4: LD14.1 U84.6(DRAIN3)
LED5: LD10.1 U84.11(DRAIN4)
LED6: LD15.1 U84.12(DRAIN5)
LED7: LD9.1 U84.13(DRAIN6)
LED8: LD8.1 U84.14(DRAIN7)
MAIN_UART1_SEL: U110.15(P15) ; port MAIN_UART1_SEL
MCU_BOOTMODE0: R225.2 ; port MCU_BOOTMODE0
MCU_BOOTMODE1: R548.2 ; port MCU_BOOTMODE1
MCU_UART_SEL: U109.5(B1) ; port MCU_UART_SEL
MCU_UART_SEL_IO_EXP: U109.8(A1) U110.16(P16)
PRG2_ETH_LED0: R464.2 R737.2 ; port PRG2_ETH_LED0
PRG2_ETH_LED1: R458.2 R738.2 ; port PRG2_ETH_LED1
RESET_SoC_MPU: U110.12(P12) ; port RESET_SoC_MPU
SOC_I2C0_SCL: U84.15(SCL) U110.19(SCL) ; port SOC_I2C0_SCL
SOC_I2C0_SDA: U84.2(SDA) U110.20(SDA) ; port SOC_I2C0_SDA
TCA9555_EXP_INT: R661.1 U110.22(~{INT})
WKUP_UART_SEL: U110.14(P14) ; port WKUP_UART_SEL
NetLD8_2: LD8.2 R103.2
NetLD9_2: LD9.2 R104.2
NetLD10_2: LD10.2 R106.2
NetLD11_2: LD11.2 R107.2
NetLD12_2: LD12.2 R108.2
NetLD13_2: LD13.2 R109.2
NetLD14_2: LD14.2 R110.2
NetLD15_2: LD15.2 R105.2
NetLD16_1: LD16.1 Q10.3(D)
NetLD16_2: LD16.2 R155.1
NetLD17_1: LD17.1 Q11.3(D)
NetLD17_2: LD17.2 R177.1
NetLD18_1: LD18.1(CATHODE1) Q17.3(D)
NetLD18_2: LD18.2(CATHODE2) Q6.3(D)
NetLD18_3: LD18.3(ANODE) R224.1
NetQ6_1: Q6.1(G) R225.1
NetQ10_1: Q10.1(G) R458.1
NetQ11_1: Q11.1(G) R464.1
NetQ17_1: Q17.1(G) R548.1
NetR431_2: R431.2 U84.7(A2)
NetR453_2: R453.2 U84.10(A1)
NetR454_2: R454.2 U84.9(A0)
NetR659_2: R659.2 U110.24(A2)
NetR660_2: R660.2 U110.23(A1)
NetR667_1: R667.1 U110.18(A0)
NetR672_1: R672.1 U109.10(DIR1)
NetR673_1: R673.1 U109.2(~{OE})
NetR680_1: R680.1 U109.1(DIR2)

Not connected (* = marked no-connect by the designer): U110 17(P17)*

### Notes on the sheet
- ETHERNET LED's
- I2C ADDRESS: 0x60
- I2C IO Expander
- I2C ADDRESS: 0x21
- (in symbol LED3_SML-LX15IGC) GREEN; RED
- (in symbol MISTRAL_TITLEBLK_CSIZE) Title; Designed for TI by Mistral Solutions Pvt Ltd; Size; Rev; Date:; Sheet; of

### Library data of the parts
*#37 = MISTRAL_TITLEBLK_CSIZE: Issue: 1.0; Page Create Date: March  8, 1995; Page Modify Date: *
C389 C658 C661 = CAP_Dup5: as C145 on sheet 36-ETHERNET PHY CLOCK GENERATOR; Tolerance: 10%; Voltage: 16V; Package: 0201; Distributor_name: DIGIKEY; Distributor_part_number: 490-16742-1-ND; Height: 0.33MM; Weight: 0.33mg; Temperature: -55°C+85°C; Datasheet: Y:\MIS_DATABASE\DATASHEETS\CAPACITORS\GRM033R61C104KE84.PDF; Crtd /date: MANIRAJA/120218; Chkd/date: MANIRAJA/120218; MECHANICAL 3D STEP FILE: CAP0201_0-5; PCB Footprint: CAP0201_0-5; Library Ref: CAP
C662 = CAP_Dup5: as C160 on sheet 36-ETHERNET PHY CLOCK GENERATOR; MECHANICAL 3D STEP FILE: CAP0201_0-5; Chkd/date: MANIRAJA/120218; Crtd /date: MANIRAJA/120218; Datasheet: Y:\MIS_DATABASE\DATASHEETS\CAPACITORS\GRM033R61C104KE84.PDF; Temperature: -55°C+85°C; Weight: 0.33mg; Height: 0.33MM; Distributor_part_number: 490-16742-1-ND; Distributor_name: DIGIKEY; Package: 0201; Voltage: 16V; Tolerance: 10%; PCB Footprint: CAP0201_0-5; Library Ref: CAP
LD8 LD9 LD12-LD15 = LED_598-8170-107F: LED ALINGAP GREEN CLEAR 0805; Mistral Part No: 130014050065-R; Mfr_name: DIALIGHT; Part_type: OPTO\LED; Project: AEGIS GP BETA2; Tolerance: NA; Customs_HS_Code: 85437099; Custom_Duty: 24%; Mfr_part_number: 598-8170-107F; Voltage: NA; Wattage: NA; Package: 0805; Distributor_name: DIGIKEY; Distributor_part_number: 350-2044-1-ND; Height: 0.70MM; Weight: NA; Temperature: -30°C+85°C; Datasheet: Y:\MIS_DATABASE\DATASHEETS\DISCRETES\LEDS\598-SER.PDF; Crtd /date: SARANYA/070514; Chkd/date: MANIRAJA/230817; MECHANICAL 3D STEP FILE: LED_0805_0-7; PCB Footprint: LED_0805_0-7; Library Ref: LED_598-8170-107F
LD10 LD11 LD17 = LED_598-8170-107F: LED ALINGAP GREEN CLEAR 0805; Part_type: OPTO\LED; Mfr_name: DIALIGHT; Mistral Part No: 130014050065-R; Custom_Duty: 24%; Customs_HS_Code: 85437099; Wattage: NA; Project: AEGIS GP BETA2; MECHANICAL 3D STEP FILE: LED_0805_0-7; Chkd/date: MANIRAJA/230817; Crtd /date: SARANYA/070514; Datasheet: Y:\MIS_DATABASE\DATASHEETS\DISCRETES\LEDS\598-SER.PDF; Temperature: -30°C+85°C; Weight: NA; Height: 0.70MM; Distributor_part_number: 350-2044-1-ND; Distributor_name: DIGIKEY; Package: 0805; Voltage: NA; Tolerance: NA; Mfr_part_number: 598-8170-107F; PCB Footprint: LED_0805_0-7; Library Ref: LED_598-8170-107F
LD16 = LED_598-8170-107F: LED ALINGAP RED CLEAR 0805 SMD; Part_type: OPTO\LED; Mfr_name: DIALIGHT; Mistral Part No: 130014050069-R; Custom_Duty: 24%; Customs_HS_Code: 85437099; Wattage: NA; Project: AEGIS GP BETA2; PCB Footprint: LED_0805; Chkd/date: BALACHANDAR/160514; Crtd /date: SARANYA/070514; Datasheet: Y:\MIS_DATABASE\DATASHEETS\DISCRETES\LEDS\598-SER.PDF; Temperature: NA; Weight: NA; Height: 0.70MM; Distributor_part_number: 350-2038-1-ND; Distributor_name: DIGIKEY; Package: 0805; Voltage: NA; Tolerance: NA; Mfr_part_number: 598-8110-107F; Library Ref: LED_598-8170-107F
LD18 = LED3_SML-LX15IGC: DIODE LED GREEN/RED SMD; Part_type: OPTO\LED; Mfr_name: LUMEX; Mistral Part No: 130017090021-R; Custom_Duty: 24%; Customs_HS_Code: 85439000; Wattage: NA; Project: TI_MAXIE_CPB; PCB Footprint: LED3_SML-LX15IGC_120X120_SMD_1; MECHANICAL 3D STEP FILE: LED3_SML-LX15IGC_120X120_SMD_1; Chkd/date: MANIRAJA/180917; Crtd /date: MANIRAJA/180917; Datasheet: Y:\MIS_DATABASE\DATASHEETS\DISCRETES\LEDS\SML-LX15IGC.PDF; Temperature: -40°C+85°C; Weight: NA; Height: 1.00MM; Distributor_part_number: 67-2193-1-ND; Distributor_name: DIGIKEY; Package: SMD; Voltage: NA; Tolerance: NA; Mfr_part_number: SML-LX15IGC-TR; Library Ref: LED3_SML-LX15IGC
Q6 Q10 Q11 = MOSFET_BSS138LT1G: IC MOSFET N-CHANNEL 50V, SOT23-3; Part_type: ICS\POWER\MOSFET; Mfr_name: ON SEMICONDUCTOR; Mistral Part No: 142016040001-R; Custom_Duty: 15%; Customs_HS_Code: 85423100; Wattage: NA; Project: LRDE_ABCM; PCB Footprint: SOT23-123; Chkd/date: VASANTHA/150416; Crtd /date: JEBRAN/060416; Datasheet: Y:\MIS_DATABASE\DATASHEETS\DISCRETES\TRANSISTORS_FETS\BSS138LT1G.PDF; Temperature: -55°C+150°C; Weight: NA; Height: 1.11MM; Distributor_part_number: 863-BSS138LT1G; Distributor_name: MOUSER; Package: SOT23-3; Voltage: 50V; Tolerance: NA; Mfr_part_number: BSS138LT1G; Library Ref: MOSFET_BSS138LT1G
Q17 = MOSFET_BSS138LT1G: IC MOSFET N-CHANNEL 50V, SOT23-3; Mistral Part No: 142016040001-R; Mfr_name: ON SEMICONDUCTOR; Part_type: ICS\POWER\MOSFET; Project: LRDE_ABCM; Tolerance: NA; Customs_HS_Code: 85423100; Custom_Duty: 15%; PCB Footprint: SOT23-123; Mfr_part_number: BSS138LT1G; Voltage: 50V; Wattage: NA; Package: SOT23-3; Distributor_name: MOUSER; Distributor_part_number: 863-BSS138LT1G; Height: 1.11MM; Weight: NA; Temperature: -55°C+150°C; Datasheet: Y:\MIS_DATABASE\DATASHEETS\DISCRETES\TRANSISTORS_FETS\BSS138LT1G.PDF; Crtd /date: JEBRAN/060416; Chkd/date: VASANTHA/150416; Library Ref: MOSFET_BSS138LT1G
R103-R105 R109 R110 = RESISTOR_Dup5: RES 220E 1/16W 5% 0402; Mistral Part No: 110009030506-R; Mfr_name: PANASONIC-ECG; Mfr_part_number: ERJ-2GEJ221X; Part_type: RESISTORS\FIXED; Project: RED EYE; Customs_HS_Code: 85332119; Custom_Duty: 15%; Voltage: NA; Tolerance: 5%; Wattage: 1/16W; Package: 0402; Distributor_name: DIGIKEY; Distributor_part_number: P220JCT-ND; Height: 0.40MM; Datasheet: Y:\MIS_DATABASE\DATASHEETS\RESISTORS\ERJ12.PDF; Crtd /date: GEETHA/260406; Chkd/date: VASANTHA/291216; Library Ref: RESISTOR; PCB Footprint: RES0402_0-5; Weight: 0.8g/1000pcs; Temperature: -55°C+155°C; MECHANICAL 3D STEP FILE: RES0402_0-5; Library Path: Y:\MIS_DATABASE\Library\ALTIUM_TOOL\SCHEMATICS_PARTS\MS_DISCRETE_Library.schlib; Footprint Path: Y:\MIS_DATABASE\Library\ALTIUM_TOOL\PCB_FOOTPRINTS\Altium_Footprint_Lib.PcbLib
R106-R108 R155 R177 R224 = RESISTOR_Dup5: RES 220E 1/16W 5% 0402; Part_type: RESISTORS\FIXED; Mfr_part_number: ERJ-2GEJ221X; Mfr_name: PANASONIC-ECG; Mistral Part No: 110009030506-R; Custom_Duty: 15%; Customs_HS_Code: 85332119; Project: RED EYE; Voltage: NA; Chkd/date: VASANTHA/291216; Crtd /date: GEETHA/260406; Datasheet: Y:\MIS_DATABASE\DATASHEETS\RESISTORS\ERJ12.PDF; Height: 0.40MM; Distributor_part_number: P220JCT-ND; Distributor_name: DIGIKEY; Package: 0402; Wattage: 1/16W; Tolerance: 5%; Library Ref: RESISTOR; PCB Footprint: RES0402_0-5; Weight: 0.8g/1000pcs; Temperature: -55°C+155°C; MECHANICAL 3D STEP FILE: RES0402_0-5; Library Path: Y:\MIS_DATABASE\Library\ALTIUM_TOOL\SCHEMATICS_PARTS\MS_DISCRETE_Library.schlib; Footprint Path: Y:\MIS_DATABASE\Library\ALTIUM_TOOL\PCB_FOOTPRINTS\Altium_Footprint_Lib.PcbLib
R225 R458 R548 = RESISTOR_Dup4: as R191 on sheet 36-ETHERNET PHY CLOCK GENERATOR; PCB Footprint: RES0402_0-5; MECHANICAL 3D STEP FILE: RES0402_0-5; RoHS: Pb-Free; Chkd/date: VASANTHA/201216; Crtd /date: MUDDU/190810; Datasheet: Y:\MIS_DATABASE\DATASHEETS\RESISTORS\CRCW0603.PDF; Temperature: -55°C+155°C; Weight: 0.65g/1000pcs; Height: 0.40MM; Distributor_part_number: 541-0.0JCT-ND; Distributor_name: DIGIKEY; Package: 0402; Wattage: 1/16W; Tolerance: NA; Library Ref: RESISTOR; Footprint Ref: RES0402_0-5; Library Path: Y:\MIS_DATABASE\Library\ALTIUM_TOOL\SCHEMATICS_PARTS\MS_DISCRETE_Library.schlib; Footprint Path: Y:\MIS_DATABASE\Library\ALTIUM_TOOL\PCB_FOOTPRINTS\Altium_Footprint_Lib.PcbLib
R431 R454 R659 R661 R667 = RESISTOR_Dup5: as R199 on sheet 36-ETHERNET PHY CLOCK GENERATOR; Tolerance: 5%; Wattage: 1/16W; Package: 0402; Distributor_name: DIGIKEY; Distributor_part_number: 311-10KJRCT-ND; Height: 0.40MM; Weight: 0.65mg; Temperature: -55°C+155°C; Datasheet: Y:\MIS_DATABASE\DATASHEETS\RESISTORS\YAGEO-RC0402.PDF; Crtd /date: MAZHAR/230805; Chkd/date: VASANTHA/061216; RoHS: Pb-Free; MECHANICAL 3D STEP FILE: RES0402_0-5; PCB Footprint: RES0402_0-5; Library Ref: RESISTOR; Footprint Ref: RES0402_0-5; Library Path: Y:\MIS_DATABASE\Library\ALTIUM_TOOL\SCHEMATICS_PARTS\MS_DISCRETE_Library.schlib; Footprint Path: Y:\MIS_DATABASE\Library\ALTIUM_TOOL\PCB_FOOTPRINTS\Altium_Footprint_Lib.PcbLib
R453 R660 R672 R673 R680 R707 R737 R738 = RESISTOR_Dup5: as R189 on sheet 36-ETHERNET PHY CLOCK GENERATOR; MECHANICAL 3D STEP FILE: RES0402_0-5; RoHS: Pb-Free; Chkd/date: VASANTHA/061216; Crtd /date: MAZHAR/230805; Datasheet: Y:\MIS_DATABASE\DATASHEETS\RESISTORS\YAGEO-RC0402.PDF; Temperature: -55°C+155°C; Weight: 0.65mg; Height: 0.40MM; Distributor_part_number: 311-10KJRCT-ND; Distributor_name: DIGIKEY; Package: 0402; Wattage: 1/16W; Tolerance: 5%; PCB Footprint: RES0402_0-5; Library Ref: RESISTOR; Footprint Ref: RES0402_0-5; Library Path: Y:\MIS_DATABASE\Library\ALTIUM_TOOL\SCHEMATICS_PARTS\MS_DISCRETE_Library.schlib; Footprint Path: Y:\MIS_DATABASE\Library\ALTIUM_TOOL\PCB_FOOTPRINTS\Altium_Footprint_Lib.PcbLib
R464 = RESISTOR_Dup4: as R194 on sheet 36-ETHERNET PHY CLOCK GENERATOR; PCB Footprint: RES0402_0-5; Voltage: NA; Wattage: 1/16W; Package: 0402; Distributor_name: DIGIKEY; Distributor_part_number: 541-0.0JCT-ND; Height: 0.40MM; Weight: 0.65g/1000pcs; Temperature: -55°C+155°C; Datasheet: Y:\MIS_DATABASE\DATASHEETS\RESISTORS\CRCW0603.PDF; Crtd /date: MUDDU/190810; Chkd/date: VASANTHA/201216; RoHS: Pb-Free; MECHANICAL 3D STEP FILE: RES0402_0-5; Library Ref: RESISTOR; Footprint Ref: RES0402_0-5; Library Path: Y:\MIS_DATABASE\Library\ALTIUM_TOOL\SCHEMATICS_PARTS\MS_DISCRETE_Library.schlib; Footprint Path: Y:\MIS_DATABASE\Library\ALTIUM_TOOL\PCB_FOOTPRINTS\Altium_Footprint_Lib.PcbLib
U84 = TPIC2810D_SOIC16: IC 8-BIT LED DRIVER WITH I2C INTERFACE SOIC16; Mistral Part No: 141017080026-R; Mfr_name: TEXAS INSTRUMENTS; Part_type: ICS\INTERFACE; Project: TI_MAXIE_CPB; Tolerance: NA; Customs_HS_Code: 85423100; Custom_Duty: 15%; Mfr_part_number: TPIC2810D; Voltage: NA; Wattage: NA; Package: SOIC16; Distributor_name: DIGIKEY; Distributor_part_number: 296-13746-5-ND; Height: 1.75MM; Weight: NA; Temperature: -40°C+125°C; Datasheet: Y:\MIS_DATABASE\DATASHEETS\ICS\INTERFACE\TPIC2810D.PDF; Crtd /date: MANIRAJA/220817; Chkd/date: MANIRAJA/230817; MECHANICAL 3D STEP FILE: SOIC16_1-8; PCB Footprint: SOIC16_1-8; Library Ref: TPIC2810D_SOIC16
U109 = SN74AVC2T245RSWR_QFN10: IC DUAL-BIT DUAL SUPPLY BUS TRANSCEIVER QFN10; Mistral Part No: 143009030061-R; Mfr_name: TEXAS INSTRUMENTS; Part_type: ICS\TELECOM\TRANSCEIVER; Project: AXON; Customs_HS_Code: 85423100; Custom_Duty: 15%; Mfr_part_number: SN74AVC2T245RSWR; Package: QFN10; Distributor_name: DIGIKEY; Distributor_part_number: 296-23684-1-ND; Height: 0.55MM; Temperature: -40°C+85°C; Datasheet: Y:\MIS_DATABASE\DATASHEETS\ICS\DIGITAL\BUSTRANSCEIVER\SN74AVC2T245RSWR.PDF; Crtd /date: USMAN/130309; Chkd/date: SUHAS/031110; RoHS: Sb/ Br FREE; PCB Footprint: QFN10_15-74_75X60; Library Ref: SN74AVC2T245RSWR_QFN10
U110 = TCA9555RTWR_WQFN24: IC I/O EXPANDER I2C BUS 16-BIT WQFN24; Part_type: ICS\DIGITAL\BUSTRANSCEIVER; Mfr_name: TEXAS INSTRUMENTS; Mistral Part No: 141013080010-R; Wattage: NA; Project: RTM; Chkd/date: USMAN/120913; Crtd /date: VIJAYALAKSHMI/200813; Datasheet: Y:\MIS_DATABASE\DATASHEETS\ICS\DIGITAL\BUSTRANSCEIVER\TCA9555X.PDF; Temperature: -40°C+85°C; Weight: NA; Height: 0.80MM; Distributor_part_number: 296-24857-1-ND; Distributor_name: DIGIKEY; Package: WQFN24; Voltage: NA; Tolerance: NA; Mfr_part_number: TCA9555RTWR; PCB Footprint: QFN24_19-68_165X165; Library Ref: TCA9555RTWR_WQFN24

## Sheet 38-TEST HEADER.SchDoc
size 513 x 386 mm
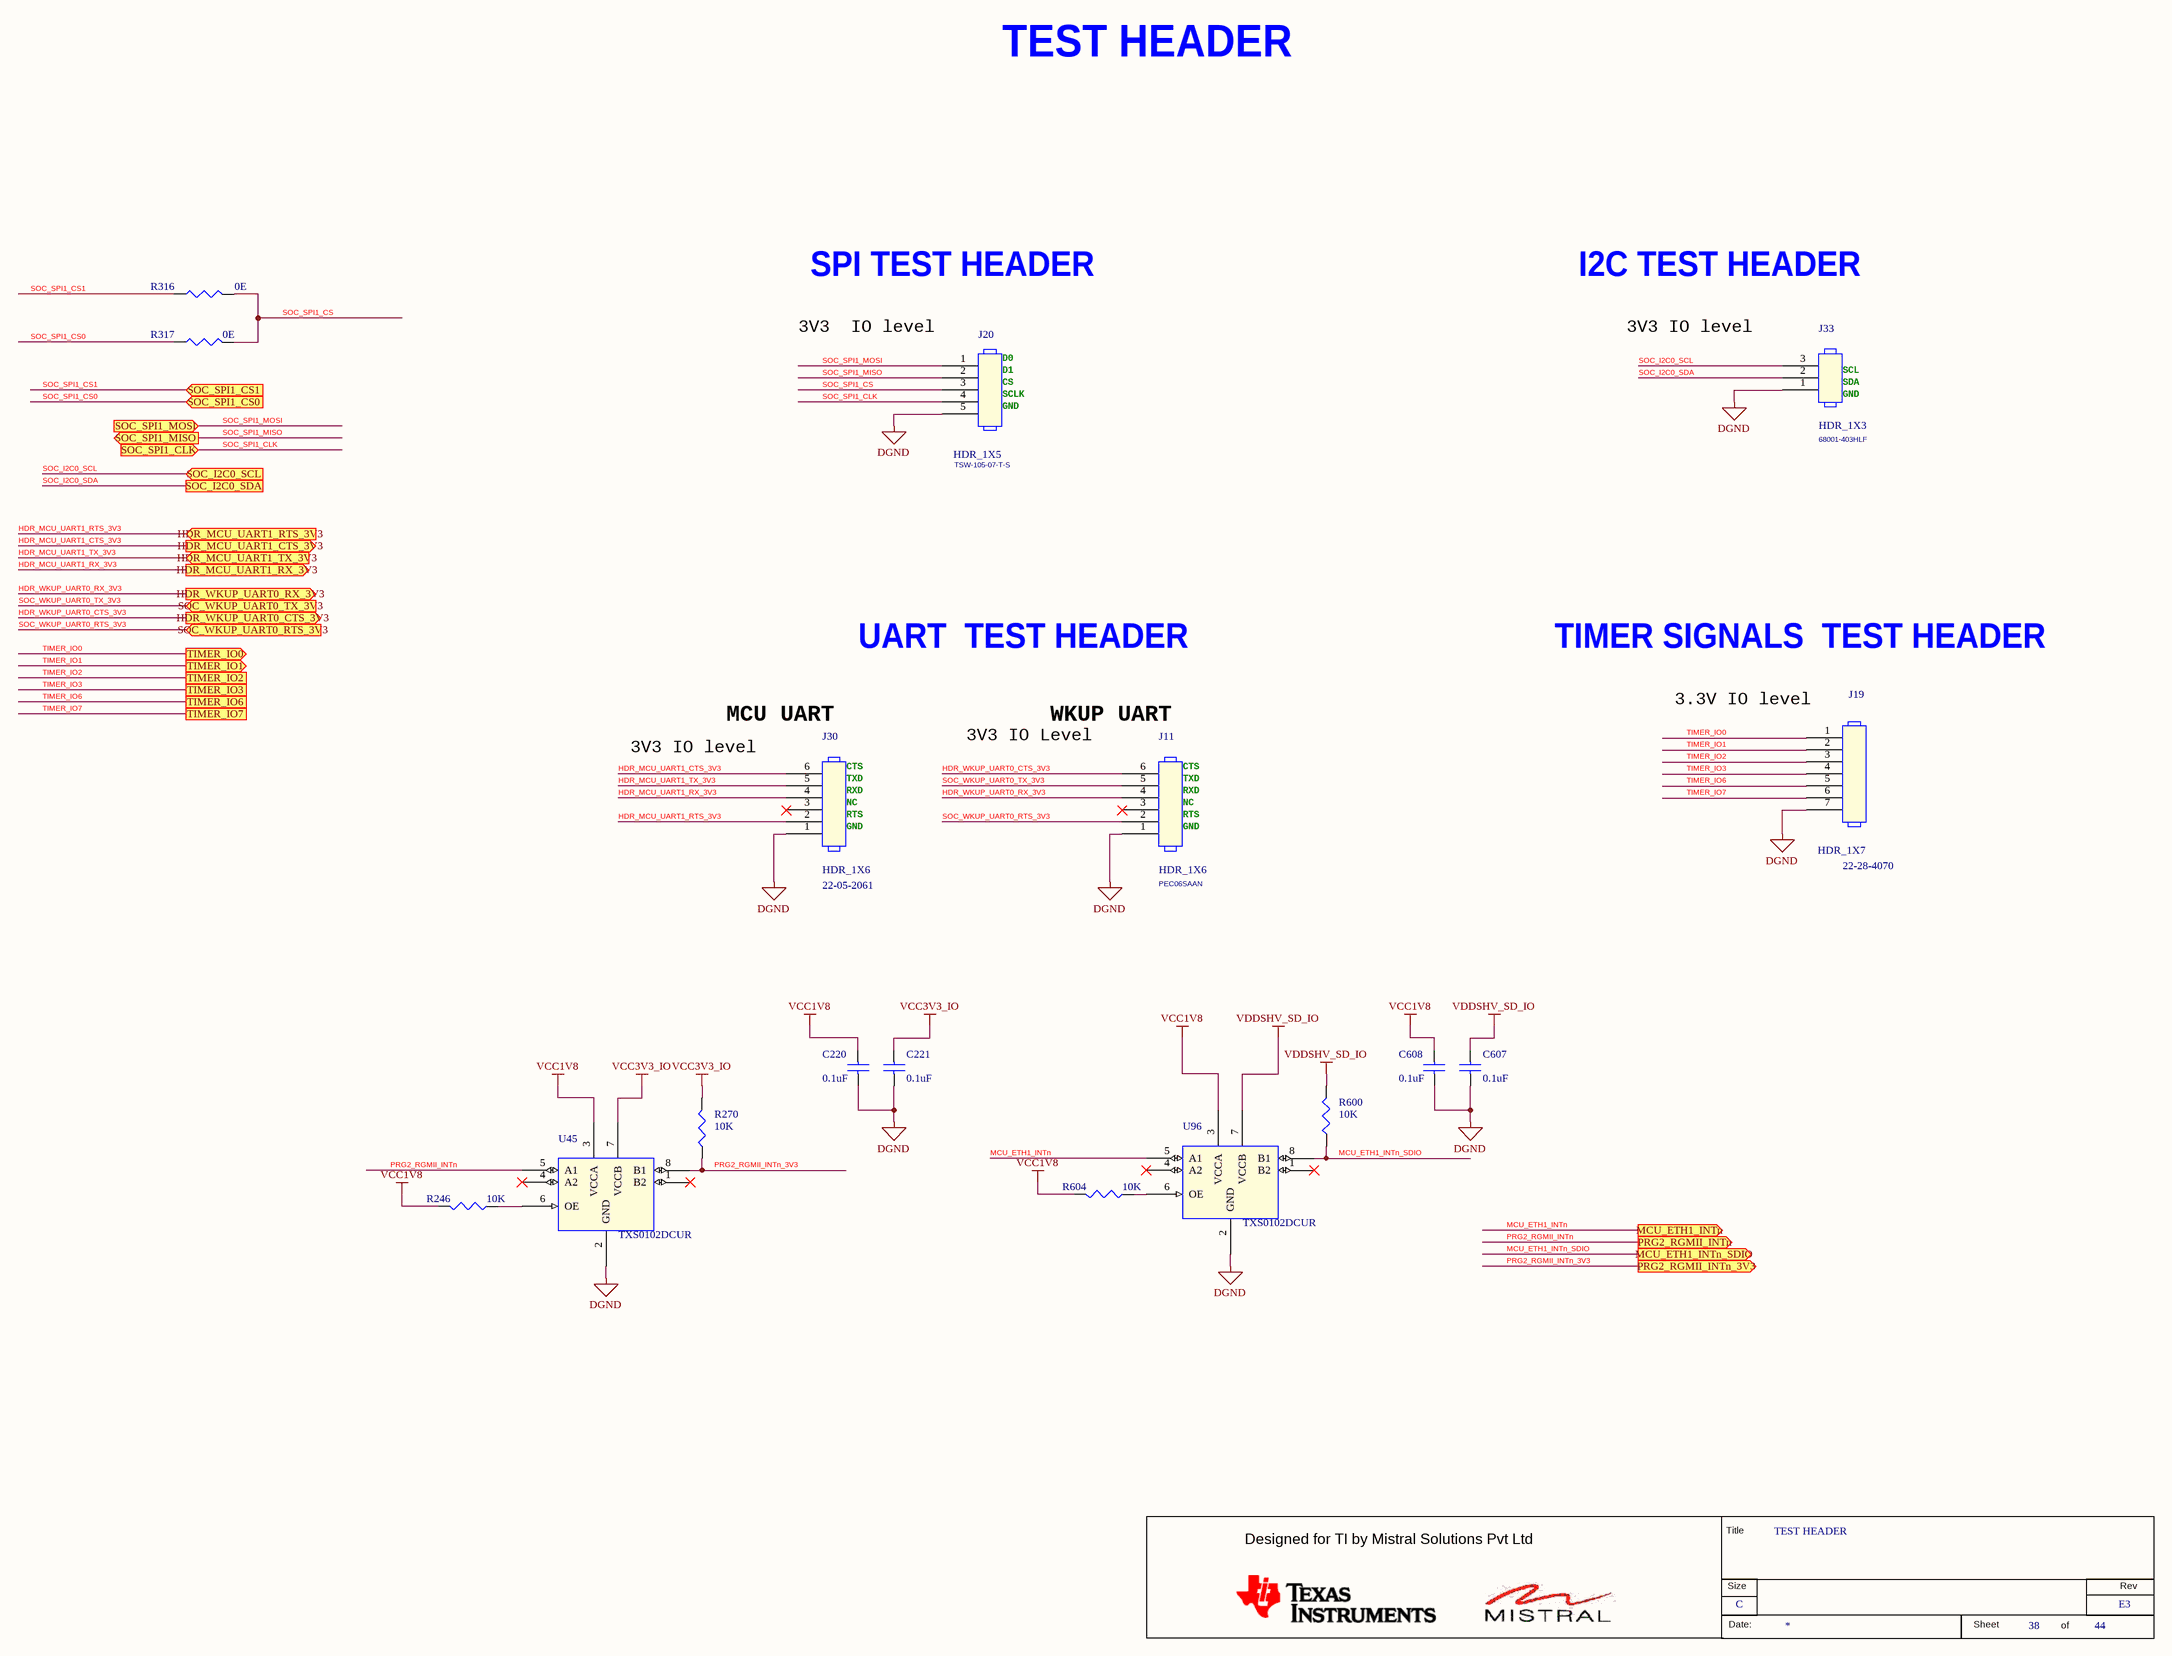
[diagram p71: 38-TEST HEADER.SchDoc]

### Parts
(Parts that share a designator on the sheet are numbered #1, #2 ... from top to bottom, then left to right.)
*#38  RevCode: E3  Title: TEST HEADER  Page Size: C  Page Number: 38  Page Count: 44  (hidden comment: MISTRAL_TITLEBLK_CSIZE)  (graphical)
C220  0.1uF  [CAP0201_0-5]
C221  0.1uF  [CAP0201_0-5]
C607  0.1uF  [CAP0201_0-5]
C608  0.1uF  [CAP0201_0-5]
J11  HDR_1X6  Mfr_part_number: PEC06SAAN  [HDR_6X1_100_S_T]
J19  HDR_1X7  Mfr_part_number: 22-28-4070  [HDR_1X7_22284070_S_T_8-4]
J20  HDR_1X5  Mfr_part_number: TSW-105-07-T-S  [HDR_5X1_100_S_T_8-4]
J30  HDR_1X6  Mfr_part_number: 22-05-2061  [HDR_1X6_22052061_R_T_6-3]
J33  HDR_1X3  Mfr_part_number: 68001-403HLF  [HDR_3X1_100_S_T]
R246  10K  [RES0402_0-5]
R270  10K  [RES0402_0-5]
R316  0E  [RES0402_0-5]
R317  0E  [RES0402_0-5]
R600  10K  [RES0402_0-5]
R604  10K  [RES0402_0-5]
U45  TXS0102DCUR  [VSSOP8_19-68_85X95_0-9]
U96  TXS0102DCUR  [VSSOP8_19-68_85X95_0-9]

### Ports
HDR_MCU_UART1_CTS_3V3 (out), HDR_MCU_UART1_RTS_3V3 (in), HDR_MCU_UART1_RX_3V3 (out), HDR_MCU_UART1_TX_3V3 (in), HDR_WKUP_UART0_CTS_3V3 (out), HDR_WKUP_UART0_RX_3V3 (out), MCU_ETH1_INTn (out), MCU_ETH1_INTn_SDIO (out), PRG2_RGMII_INTn (out), PRG2_RGMII_INTn_3V3 (out), SOC_I2C0_SCL (in), SOC_I2C0_SDA, SOC_SPI1_CLK (in), SOC_SPI1_CS0 (in), SOC_SPI1_CS1 (in), SOC_SPI1_MISO (out), SOC_SPI1_MOSI (in), SOC_WKUP_UART0_RTS_3V3 (in), SOC_WKUP_UART0_TX_3V3 (in), TIMER_IO0 (out), TIMER_IO1 (out), TIMER_IO2, TIMER_IO3, TIMER_IO6, TIMER_IO7

### Nets
DGND: C220.2 C221.2 C607.2 C608.2 J11.1 J19.7 J20.5 J30.1 J33.1 U45.2(GND) U96.2(GND)
VCC1V8: C220.1 C608.1 R246.2 R604.2 U45.3(VCCA) U96.3(VCCA)
VCC3V3_IO: C221.1 R270.2 U45.7(VCCB)
VDDSHV_SD_IO: C607.1 R600.2 U96.7(VCCB)
HDR_MCU_UART1_CTS_3V3: J30.6 ; port HDR_MCU_UART1_CTS_3V3
HDR_MCU_UART1_RTS_3V3: J30.2 ; port HDR_MCU_UART1_RTS_3V3
HDR_MCU_UART1_RX_3V3: J30.4 ; port HDR_MCU_UART1_RX_3V3
HDR_MCU_UART1_TX_3V3: J30.5 ; port HDR_MCU_UART1_TX_3V3
HDR_WKUP_UART0_CTS_3V3: J11.6 ; port HDR_WKUP_UART0_CTS_3V3
HDR_WKUP_UART0_RX_3V3: J11.4 ; port HDR_WKUP_UART0_RX_3V3
MCU_ETH1_INTn: U96.5(A1) ; port MCU_ETH1_INTn
MCU_ETH1_INTn_SDIO: R600.1 U96.8(B1) ; port MCU_ETH1_INTn_SDIO
PRG2_RGMII_INTn: U45.5(A1) ; port PRG2_RGMII_INTn
PRG2_RGMII_INTn_3V3: R270.1 U45.8(B1) ; port PRG2_RGMII_INTn_3V3
SOC_I2C0_SCL: J33.3 ; port SOC_I2C0_SCL
SOC_I2C0_SDA: J33.2 ; port SOC_I2C0_SDA
SOC_SPI1_CLK: J20.4 ; port SOC_SPI1_CLK
SOC_SPI1_CS: J20.3 R316.1 R317.1
SOC_SPI1_CS0: R317.2 ; port SOC_SPI1_CS0
SOC_SPI1_CS1: R316.2 ; port SOC_SPI1_CS1
SOC_SPI1_MISO: J20.2 ; port SOC_SPI1_MISO
SOC_SPI1_MOSI: J20.1 ; port SOC_SPI1_MOSI
SOC_WKUP_UART0_RTS_3V3: J11.2 ; port SOC_WKUP_UART0_RTS_3V3
SOC_WKUP_UART0_TX_3V3: J11.5 ; port SOC_WKUP_UART0_TX_3V3
TIMER_IO0: J19.1 ; port TIMER_IO0
TIMER_IO1: J19.2 ; port TIMER_IO1
TIMER_IO2: J19.3 ; port TIMER_IO2
TIMER_IO3: J19.4 ; port TIMER_IO3
TIMER_IO6: J19.5 ; port TIMER_IO6
TIMER_IO7: J19.6 ; port TIMER_IO7
NetR246_1: R246.1 U45.6(OE)
NetR604_1: R604.1 U96.6(OE)

Not connected (* = marked no-connect by the designer): J11 3*; J30 3*; U45 1(B2)* 4(A2)*; U96 1(B2)* 4(A2)*

### Notes on the sheet
- TEST HEADER
- SPI TEST HEADER
- I2C TEST HEADER
- 3V3  IO level
- 3V3 IO level
- (near J20) SCLK
- (near J20) D0
- (near J20) D1
- (near J20) CS
- (near J20) GND
- (near J33) SCL
- (near J33) SDA
- (near J33) GND
- UART  TEST HEADER
- TIMER SIGNALS  TEST HEADER
- 3.3V IO level
- (near J30) MCU UART
- (near J30) CTS
- 3V3 IO Level
- (near J11) WKUP UART
- (near J11) CTS
- (near J30) GND
- (near J30) TXD
- (near J30) RTS
- (near J30) RXD
- (near J30) NC
- (near J11) GND
- (near J11) TXD
- (near J11) RTS
- (near J11) RXD
- (near J11) NC
- (in symbol MISTRAL_TITLEBLK_CSIZE) Title; Designed for TI by Mistral Solutions Pvt Ltd; Size; Rev; Date:; Sheet; of

### Library data of the parts
*#38 = MISTRAL_TITLEBLK_CSIZE: Issue: 1.0; Page Create Date: March  8, 1995; Page Modify Date: *
C220 C608 = CAP_Dup5: as C160 on sheet 36-ETHERNET PHY CLOCK GENERATOR; Library Ref: CAP; PCB Footprint: CAP0201_0-5; MECHANICAL 3D STEP FILE: CAP0201_0-5; Chkd/date: MANIRAJA/120218; Crtd /date: MANIRAJA/120218; Datasheet: Y:\MIS_DATABASE\DATASHEETS\CAPACITORS\GRM033R61C104KE84.PDF; Temperature: -55°C+85°C; Weight: 0.33mg; Height: 0.33MM; Distributor_part_number: 490-16742-1-ND; Distributor_name: DIGIKEY; Package: 0201; Voltage: 16V; Tolerance: 10%
C221 C607 = CAP_Dup5: as C145 on sheet 36-ETHERNET PHY CLOCK GENERATOR; Library Ref: CAP; PCB Footprint: CAP0201_0-5; Tolerance: 10%; Voltage: 16V; Package: 0201; Distributor_name: DIGIKEY; Distributor_part_number: 490-16742-1-ND; Height: 0.33MM; Weight: 0.33mg; Temperature: -55°C+85°C; Datasheet: Y:\MIS_DATABASE\DATASHEETS\CAPACITORS\GRM033R61C104KE84.PDF; Crtd /date: MANIRAJA/120218; Chkd/date: MANIRAJA/120218; MECHANICAL 3D STEP FILE: CAP0201_0-5
J11 = HEADER_6X1: HDR 1X6 2.54 PITCH ST TH; Mistral Part No: 150016060022-R; Mfr_name: SULLINS; Part_type: CONNECTOR\HEADERS; Project: NTR_GPSDO BOX CARD; Tolerance: NA; Customs_HS_Code: 85369090; Custom_Duty: 24%; Library Ref: HEADER_6X1; PCB Footprint: HDR_6X1_100_S_T; Voltage: NA; Wattage: NA; Package: THRU HOLE; Distributor_name: DIGIKEY; Distributor_part_number: S1012E-06-ND; Height: 8.38MM; Weight: NA; Temperature: -65°C+125°C; Datasheet: Y:\MIS_DATABASE\DATASHEETS\CONNECTORS\PECXXX_SERIES.PDF; Crtd /date: VASANTHA/220616; Chkd/date: VASANTHA/220616
J19 = HEADER_7X1: CON HDR 1X7 2.54MM PITCH ST TH; Part_type: CONNECTOR\HEADERS; Mfr_name: MOLEX; Mistral Part No: 150018010021-R; Custom_Duty: 24%; Customs_HS_Code: 85369090; Wattage: NA; Project: TI_MAXIE_CPB; Library Ref: HEADER_7X1; MECHANICAL 3D STEP FILE: HDR_1X7_22284070_S_T_8-4; Chkd/date: MANIRAJA/230118; Crtd /date: ALVY/230118; Datasheet: Y:\MIS_DATABASE\DATASHEETS\CONNECTORS\22-28-SER.PDF; Temperature: NA; Weight: 431mg; Height: 8.38MM; Distributor_part_number: WM50014-07-ND; Distributor_name: DIGIKEY; Package: THRU-HOLE; Voltage: NA; Tolerance: NA; PCB Footprint: HDR_1X7_22284070_S_T_8-4
J20 = HEADER_5X1: CON HDR 1X5 2.54MM PITCH ST TH; Part_type: CONNECTOR\HEADERS; Mfr_name: SAMTEC; Mistral Part No: 150017090001-R; Custom_Duty: 24%; Customs_HS_Code: 85369090; Wattage: NA; Project: TI_MAXIE_CPB; Library Ref: HEADER_5X1; PCB Footprint: HDR_5X1_100_S_T_8-4; MECHANICAL 3D STEP FILE: HDR_5X1_100_S_T_8-4; Chkd/date: MANIRAJA/010917; Crtd /date: MANIRAJA/010917; Datasheet: Y:\MIS_DATABASE\DATASHEETS\CONNECTORS\TSW-MK.PDF; Temperature: -55°C+105°C; Weight: NA; Height: 8.38MM; Distributor_part_number: SAM1035-05-ND; Distributor_name: DIGIKEY; Package: THRU-HOLE; Voltage: NA; Tolerance: NA
J30 = HEADER_6X1: CON HDR 1X6 2.54MM PITCH RT TH; Mistral Part No: 150018010023-R; Mfr_name: MOLEX; Part_type: CONNECTOR\HEADERS; Project: TI_MAXIE_CPB; Tolerance: NA; Customs_HS_Code: 85369090; Custom_Duty: 24%; Library Ref: HEADER_6X1; Voltage: NA; Wattage: NA; Package: THRU-HOLE; Distributor_name: DIGIKEY; Distributor_part_number: WM4104-ND; Height: 6.30MM; Weight: 484mg; Temperature: NA; Datasheet: Y:\MIS_DATABASE\DATASHEETS\CONNECTORS\A-4094-SER.PDF; Crtd /date: MANIRAJA/240118; Chkd/date: MANIRAJA/240118; PCB Footprint: HDR_1X6_22052061_R_T_6-3; MECHANICAL 3D STEP FILE: HDR_1X6_22052061_R_T_6-3
J33 = HEADER_3X1: HDR 1X3 2.54MM PITCH ST TH; Part_type: CONNECTOR\HEADERS; Mfr_name: FCI; Mistral Part No: 150016060025-R; Custom_Duty: 15%; Customs_HS_Code: 85322990; Wattage: NA; Project: IKEYP; Library Ref: HEADER_3X1; PCB Footprint: HDR_3X1_100_S_T; Chkd/date: VASANTHA/290616; Crtd /date: VASANTHA/290616; Datasheet: Y:\MIS_DATABASE\DATASHEETS\CONNECTORS\68000.PDF; Temperature: -40°C+105°C; Weight: NA; Height: 8.58MM; Distributor_part_number: 609-3471-ND; Distributor_name: DIGIKEY; Package: THRU-HOLE; Voltage: NA; Tolerance: NA
R246 R270 R604 = RESISTOR_Dup5: as R189 on sheet 36-ETHERNET PHY CLOCK GENERATOR; Footprint Path: Y:\MIS_DATABASE\Library\ALTIUM_TOOL\PCB_FOOTPRINTS\Altium_Footprint_Lib.PcbLib; Library Path: Y:\MIS_DATABASE\Library\ALTIUM_TOOL\SCHEMATICS_PARTS\MS_DISCRETE_Library.schlib; Footprint Ref: RES0402_0-5; Library Ref: RESISTOR; PCB Footprint: RES0402_0-5; MECHANICAL 3D STEP FILE: RES0402_0-5; RoHS: Pb-Free; Chkd/date: VASANTHA/061216; Crtd /date: MAZHAR/230805; Datasheet: Y:\MIS_DATABASE\DATASHEETS\RESISTORS\YAGEO-RC0402.PDF; Temperature: -55°C+155°C; Weight: 0.65mg; Height: 0.40MM; Distributor_part_number: 311-10KJRCT-ND; Distributor_name: DIGIKEY; Package: 0402; Wattage: 1/16W; Tolerance: 5%
R316 = RESISTOR_Dup4: RES 0E 1/16W 0402; Part_type: RESISTORS\FIXED; Mfr_part_number: CRCW04020000Z0ED; Mfr_name: VISHAY; Mistral Part No: 110010080019-P; Custom_Duty: 15%; Customs_HS_Code: 85332119; Voltage: NA; Project: PB_BUGBASE; NI_MARK: DNI; Footprint Path: Y:\MIS_DATABASE\Library\ALTIUM_TOOL\PCB_FOOTPRINTS\Altium_Footprint_Lib.PcbLib; Library Path: Y:\MIS_DATABASE\Library\ALTIUM_TOOL\SCHEMATICS_PARTS\MS_DISCRETE_Library.schlib; Footprint Ref: RES0402_0-5; Library Ref: RESISTOR; RoHS: Pb-Free; Chkd/date: VASANTHA/201216; Crtd /date: MUDDU/190810; Datasheet: Y:\MIS_DATABASE\DATASHEETS\RESISTORS\CRCW0603.PDF; Temperature: -55°C+155°C; Weight: 0.65g/1000pcs; Height: 0.40MM; Distributor_part_number: 541-0.0JCT-ND; Distributor_name: DIGIKEY; Package: 0402; Wattage: 1/16W; Tolerance: NA; PCB Footprint: RES0402_0-5; MECHANICAL 3D STEP FILE: RES0402_0-5
R317 = RESISTOR_Dup4: RES 0E 1/16W 0402; Mistral Part No: 110010080019-P; Mfr_name: VISHAY; Mfr_part_number: CRCW04020000Z0ED; Part_type: RESISTORS\FIXED; Project: PB_BUGBASE; Tolerance: NA; Customs_HS_Code: 85332119; Custom_Duty: 15%; NI_MARK: DNI; Footprint Path: Y:\MIS_DATABASE\Library\ALTIUM_TOOL\PCB_FOOTPRINTS\Altium_Footprint_Lib.PcbLib; Library Path: Y:\MIS_DATABASE\Library\ALTIUM_TOOL\SCHEMATICS_PARTS\MS_DISCRETE_Library.schlib; Footprint Ref: RES0402_0-5; Library Ref: RESISTOR; Voltage: NA; Wattage: 1/16W; Package: 0402; Distributor_name: DIGIKEY; Distributor_part_number: 541-0.0JCT-ND; Height: 0.40MM; Weight: 0.65g/1000pcs; Temperature: -55°C+155°C; Datasheet: Y:\MIS_DATABASE\DATASHEETS\RESISTORS\CRCW0603.PDF; Crtd /date: MUDDU/190810; Chkd/date: VASANTHA/201216; RoHS: Pb-Free; PCB Footprint: RES0402_0-5; MECHANICAL 3D STEP FILE: RES0402_0-5
R600 = RESISTOR_Dup5: as R199 on sheet 36-ETHERNET PHY CLOCK GENERATOR; Footprint Path: Y:\MIS_DATABASE\Library\ALTIUM_TOOL\PCB_FOOTPRINTS\Altium_Footprint_Lib.PcbLib; Library Path: Y:\MIS_DATABASE\Library\ALTIUM_TOOL\SCHEMATICS_PARTS\MS_DISCRETE_Library.schlib; Footprint Ref: RES0402_0-5; Library Ref: RESISTOR; PCB Footprint: RES0402_0-5; Tolerance: 5%; Wattage: 1/16W; Package: 0402; Distributor_name: DIGIKEY; Distributor_part_number: 311-10KJRCT-ND; Height: 0.40MM; Weight: 0.65mg; Temperature: -55°C+155°C; Datasheet: Y:\MIS_DATABASE\DATASHEETS\RESISTORS\YAGEO-RC0402.PDF; Crtd /date: MAZHAR/230805; Chkd/date: VASANTHA/061216; RoHS: Pb-Free; MECHANICAL 3D STEP FILE: RES0402_0-5
U45 U96 = TXS0102DCUR_VSSOP8: IC 2BIT BI-DIR VOLTAGE-LEVEL TRANSLATOR US8(VSSOP8); Mistral Part No: 141009030376-R; Mfr_name: TEXAS INSTRUMENTS; Part_type: ICS\INTERFACE\LEVEL TRANSLATOR; Project: SD_WATERLOO; Tolerance: NA; Customs_HS_Code: 85423100; Custom_Duty: 15%; Footprint Ref: VSSOP8_19-68_85X95_0-9; Library Ref: TXS0102DCUR_VSSOP8; PCB Footprint: VSSOP8_19-68_85X95_0-9; Mfr_part_number: TXS0102DCUR; Voltage: NA; Wattage: NA; Package: US8; Distributor_name: DIGIKEY; Distributor_part_number: 296-21931-1-ND; Height: 0.90MM; Weight: 9.6mg; Temperature: -40°C+85°C; Datasheet: Y:\MIS_DATABASE\DATASHEETS\ICS\INTERFACE\TXS0102.PDF; Crtd /date: SHREESHAIL/190108; Chkd/date: MANIRAJA/130617; MECHANICAL 3D STEP FILE: VSSOP8_19-68_85X95_0-9; Library Path: Y:\MIS_DATABASE\Library\ALTIUM_TOOL\SCHEMATICS_PARTS\MS_MISCINTERFACE_Library.schlib; Footprint Path: Y:\MIS_DATABASE\Library\ALTIUM_TOOL\PCB_FOOTPRINTS\Altium_Footprint_Lib.PcbLib